# Altium project SFCMasterD.PrjPCB (part 1 of 2)
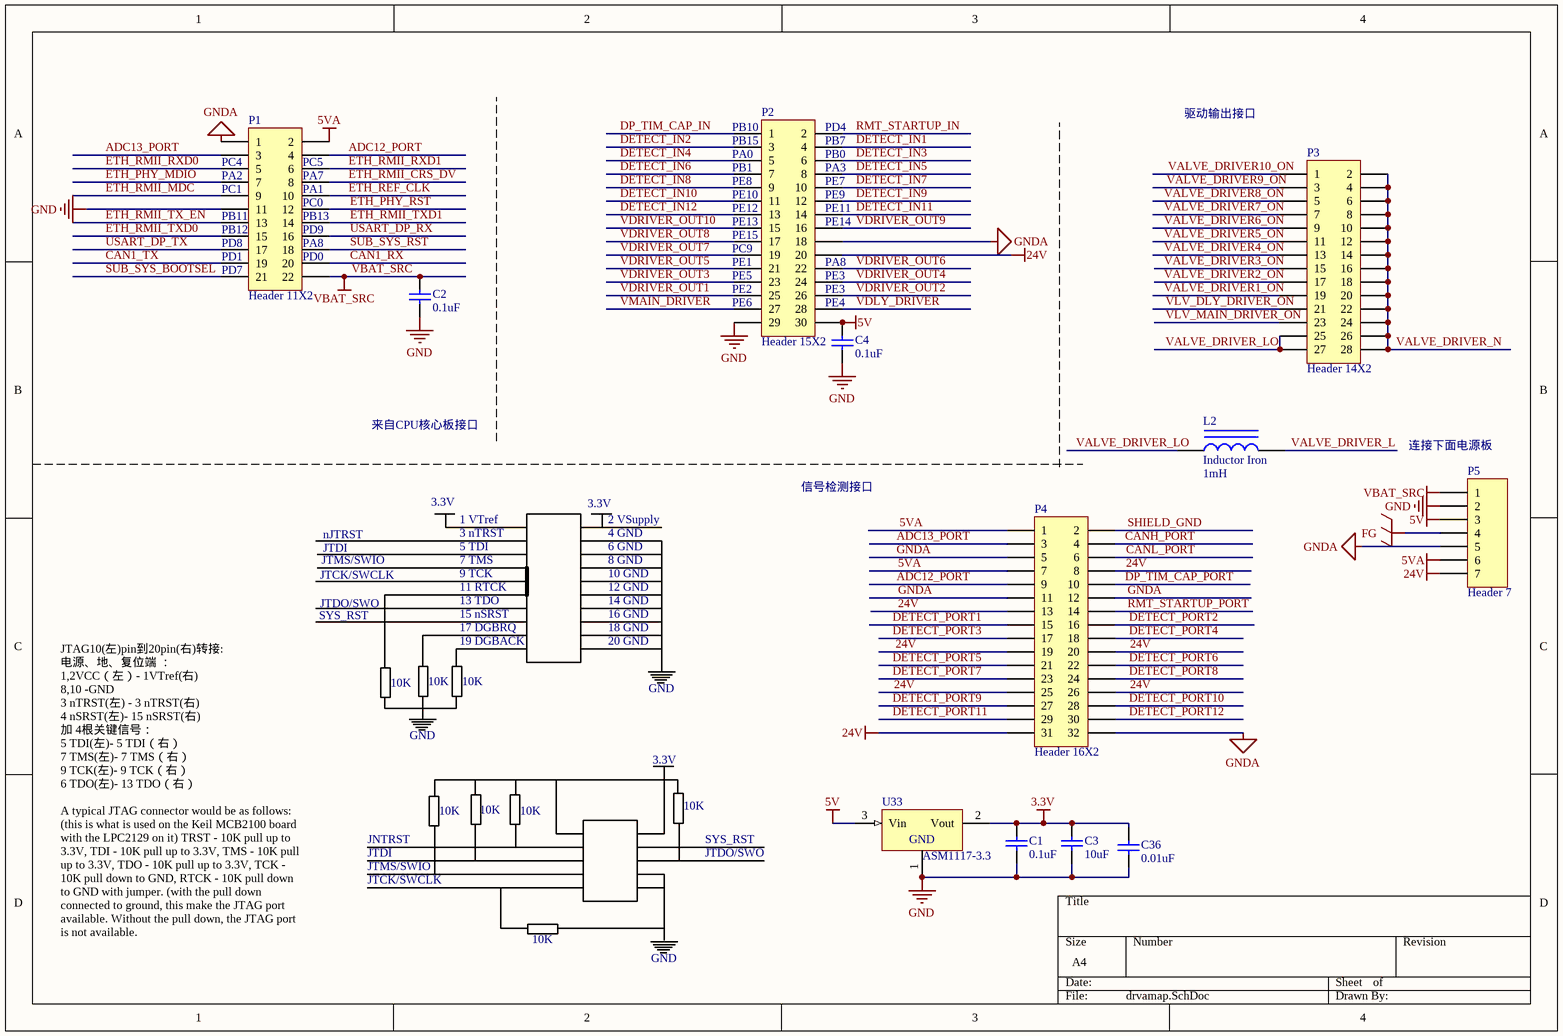
[diagram p0: drvamap.SchDoc]
17 sheets, 249 parts. Net scope: global (net labels, ports and power ports of the same name join across sheets).
Board file: SFCmasterD.PcbDoc
Sheets:
  drvamap.SchDoc
  drvcomdp.SchDoc
  drvcomm.SchDoc
  drveth.SchDoc
  drvinput0.SchDoc
  drvinput1.SchDoc
  drvinput2.SchDoc
  drvinput3.SchDoc
  drvinput4.SchDoc
  drvinput5.SchDoc
  drvinput6.SchDoc
  drvoutput0.SchDoc
  drvoutput1.SchDoc
  drvoutput2.SchDoc
  drvoutput3.SchDoc
  drvoutput4.SchDoc
  drvoutput5.SchDoc

## Sheet drvamap.SchDoc: JKA 2.0 原理图
size A4; Author: JACK; CompanyName: 北京康洁之晨水处理技术有限公司; DrawnBy: 郭相炳; Organization: 北京康洁; DocumentNumber: 6; Revision: 2.0; SheetNumber: 6; SheetTotal: 6; ImagePath: E:\JKAdoc\data\LOGO.jpg; ProjectName: JKA2.0

### Parts
C1  0.1uF  [CAPC2012M]
C2  0.1uF  [CAPC2012M]
C3  10uF  [CAPC2012M]
C4  0.1uF  [CAPC2012M]
C36  0.01uF  [CAPC2012M]
L2  Inductor Iron  value 1mH  [CAPPR5-8x8A]
P1  Header 11X2  [HDR2X11]
P2  Header 15X2  [HDR2X15]
P3  Header 14X2  [DG127A-3.81-14]
P4  Header 16X2  [DG127A-3.81-16]
P5  Header 7  [HDR1X7]
U33  ASM1117-3.3  [SOT-223]

### Nets
3.3V: C1.2 C3.2 C36.2 U33.2(Vout)
5V: C4.1 P2.30 P5.3 U33.3(Vin)
5VA: P1.2 P4.1 P4.7 P5.6
24V: P2.20 P4.8 P4.13 P4.19 P4.20 P4.25 P4.26 P4.31 P5.7
FG: P5.4
GND: C1.1 C2.2 C3.1 C4.2 C36.1 P1.11 P2.29 P5.2 U33.1(GND)
GNDA: P1.1 P2.18 P4.5 P4.11 P4.12 P4.32 P5.5
VBAT_SRC: C2.1 P1.22 P5.1
ADC12_PORT: P1.4 P4.9
ADC13_PORT: P1.3 P4.3
CAN1_RX: P1.20
CAN1_TX: P1.19
CANH_PORT: P4.4
CANL_PORT: P4.6
DETECT_IN1: P2.4
DETECT_IN2: P2.3
DETECT_IN3: P2.6
DETECT_IN4: P2.5
DETECT_IN5: P2.8
DETECT_IN6: P2.7
DETECT_IN7: P2.10
DETECT_IN8: P2.9
DETECT_IN9: P2.12
DETECT_IN10: P2.11
DETECT_IN11: P2.14
DETECT_IN12: P2.13
DETECT_PORT1: P4.15
DETECT_PORT2: P4.16
DETECT_PORT3: P4.17
DETECT_PORT4: P4.18
DETECT_PORT5: P4.21
DETECT_PORT6: P4.22
DETECT_PORT7: P4.23
DETECT_PORT8: P4.24
DETECT_PORT9: P4.27
DETECT_PORT10: P4.28
DETECT_PORT11: P4.29
DETECT_PORT12: P4.30
DP_TIM_CAP_IN: P2.1
DP_TIM_CAP_PORT: P4.10
ETH_PHY_MDIO: P1.7
ETH_PHY_RST: P1.12
ETH_REF_CLK: P1.10
ETH_RMII_CRS_DV: P1.8
ETH_RMII_MDC: P1.9
ETH_RMII_RXD0: P1.5
ETH_RMII_RXD1: P1.6
ETH_RMII_TX_EN: P1.13
ETH_RMII_TXD0: P1.15
ETH_RMII_TXD1: P1.14
RMT_STARTUP_IN: P2.2
RMT_STARTUP_PORT: P4.14
SHIELD_GND: P4.2
SUB_SYS_BOOTSEL: P1.21
SUB_SYS_RST: P1.18
USART_DP_RX: P1.16
USART_DP_TX: P1.17
VALVE_DRIVER1_ON: P3.19
VALVE_DRIVER2_ON: P3.17
VALVE_DRIVER3_ON: P3.15
VALVE_DRIVER4_ON: P3.13
VALVE_DRIVER5_ON: P3.11
VALVE_DRIVER6_ON: P3.9
VALVE_DRIVER7_ON: P3.7
VALVE_DRIVER8_ON: P3.5
VALVE_DRIVER9_ON: P3.3
VALVE_DRIVER10_ON: P3.1
VALVE_DRIVER_L: L2.2
VALVE_DRIVER_LO: L2.1 P3.25 P3.27
VALVE_DRIVER_N: P3.2 P3.4 P3.6 P3.8 P3.10 P3.12 P3.14 P3.16 P3.18 P3.20 P3.22 P3.24 P3.26 P3.28
VDLY_DRIVER: P2.28
VDRIVER_OUT1: P2.25
VDRIVER_OUT2: P2.26
VDRIVER_OUT3: P2.23
VDRIVER_OUT4: P2.24
VDRIVER_OUT5: P2.21
VDRIVER_OUT6: P2.22
VDRIVER_OUT7: P2.19
VDRIVER_OUT8: P2.17
VDRIVER_OUT9: P2.16
VDRIVER_OUT10: P2.15
VLV_DLY_DRIVER_ON: P3.21
VLV_MAIN_DRIVER_ON: P3.23
VMAIN_DRIVER: P2.27

### Notes on the sheet
- (near P1) PA2
- (near P1) PC4
- (near P1) PA7
- (near P1) PC5
- (near P2) PB10
- (near P2) PB1
- (near P2) PA0
- (near P2) PB15
- (near P2) PB7
- (near P2) PD4
- (near P2) PA3
- (near P2) PB0
- 驱动输出接口
- (near P1) PB11
- (near P1) PB12
- (near P1) PC1
- (near P1) PD8
- (near P1) PA1
- (near P1) PA8
- (near P1) PB13
- (near P1) PC0
- (near P1) PD9
- (near P2) PE15
- (near P2) PE12
- (near P2) PE13
- (near P2) PE10
- (near P2) PE8
- (near P2) PE14
- (near P2) PE11
- (near P2) PE9
- (near P2) PE7
- (near P1) PD1
- (near P1) PD7
- (near P1) PD0
- (near P2) PE6
- (near P2) PE2
- (near P2) PE5
- (near P2) PE1
- (near P2) PC9
- (near P2) PE4
- (near P2) PE3
- (near P2) PA8
- 来自CPU核心板接口
- (near P5) 连接下面电源板
- 3.3V
- 信号检测接口
- JTCK/SWCLK
- JTMS/SWIO
- nJTRST
- JTDI
- 1 VTref
- 3 nTRST
- 5 TDI
- 7 TMS
- 9 TCK
- 2 VSupply
- 4 GND
- 6 GND
- 8 GND
- 10 GND
- SYS_RST
- JTDO/SWO
- 11 RTCK
- 13 TDO
- 15 nSRST
- 17 DGBRQ
- 19 DGBACK
- 12 GND
- 14 GND
- 16 GND
- 18 GND
- 20 GND
- 10K
- GND
- JTAG10(左)pin到20pin(右)转接:
  电源、地、复位端 ：
  1,2VCC（左）- 1VTref(右)
  8,10 -GND
  3 nTRST(左) - 3 nTRST(右)
  4 nSRST(左)- 15 nSRST(右)
  加 4根关键信号：
  5 TDI(左)- 5 TDI（右）
  7 TMS(左)- 7 TMS（右）
  9 TCK(左)- 9 TCK（右）
  6 TDO(左)- 13 TDO（右）
- JNTRST
- A typical JTAG connector would be as follows: (this is what is used on the Keil MCB2100 board with the LPC2129 on it) TRST - 10K pull up to 3.3V, TDI - 10K pull up to 3.3V, TMS - 10K pull up to 3.3V, TDO - 10K pull up to 3.3V, TCK - 10K pull down to GND, RTCK - 10K pull down to GND with jumper. (with the pull down connected to ground, this make the JTAG port available. Without the pull down, the JTAG port is not available.

### Library data of the parts
C1-C4 C36 = Cap: Capacitor; Value: 1nF; Published: 8-Jun-2000; LatestRevisionDate: 17-Jul-2002; LatestRevisionNote: Re-released for DXP Platform.; PackageReference: RAD-0.3; Publisher: Altium Limited
L2 = Inductor Iron: Magnetic-Core Inductor; Published: 24-Mar-1999; LatestRevisionDate: 17-Jul-2002; LatestRevisionNote: Re-released for DXP Platform.; PackageReference: AXIAL-0.9; Publisher: Altium Limited; PackageDescription: Axial Device, Thru-Hole; 2 Leads; 0.9 in Pin Spacing
P1 = Header 11X2: Header, 11-Pin, Dual row; LatestRevisionDate: 17-Jul-2002; LatestRevisionNote: Re-released for DXP Platform.; Publisher: Altium Limited
P2 = Header 15X2: Header, 15-Pin, Dual row; LatestRevisionDate: 17-Jul-2002; LatestRevisionNote: Re-released for DXP Platform.; Publisher: Altium Limited
P3 = Header 14X2: Header, 14-Pin, Dual row; LatestRevisionDate: 17-Jul-2002; LatestRevisionNote: Re-released for DXP Platform.; Publisher: Altium Limited
P4 = Header 16X2: Header, 16-Pin, Dual row; LatestRevisionDate: 17-Jul-2002; LatestRevisionNote: Re-released for DXP Platform.; Publisher: Altium Limited
P5 = Header 7: Header, 7-Pin; LatestRevisionDate: 17-Jul-2002; LatestRevisionNote: Re-released for DXP Platform.; Publisher: Altium Limited
U33 = LM1117T-5.0: 800mA Low-Dropout Linear Regulator

## Sheet drvcomdp.SchDoc: JKA 2.0 原理图
size A4; Author: JACK; CompanyName: 北京康洁之晨水处理技术有限公司; DrawnBy: 郭相炳; Organization: 北京康洁; DocumentNumber: 6; Revision: 2.0; SheetNumber: 6; SheetTotal: 6; ImagePath: E:\JKAdoc\data\LOGO.jpg; ProjectName: JKA2.0
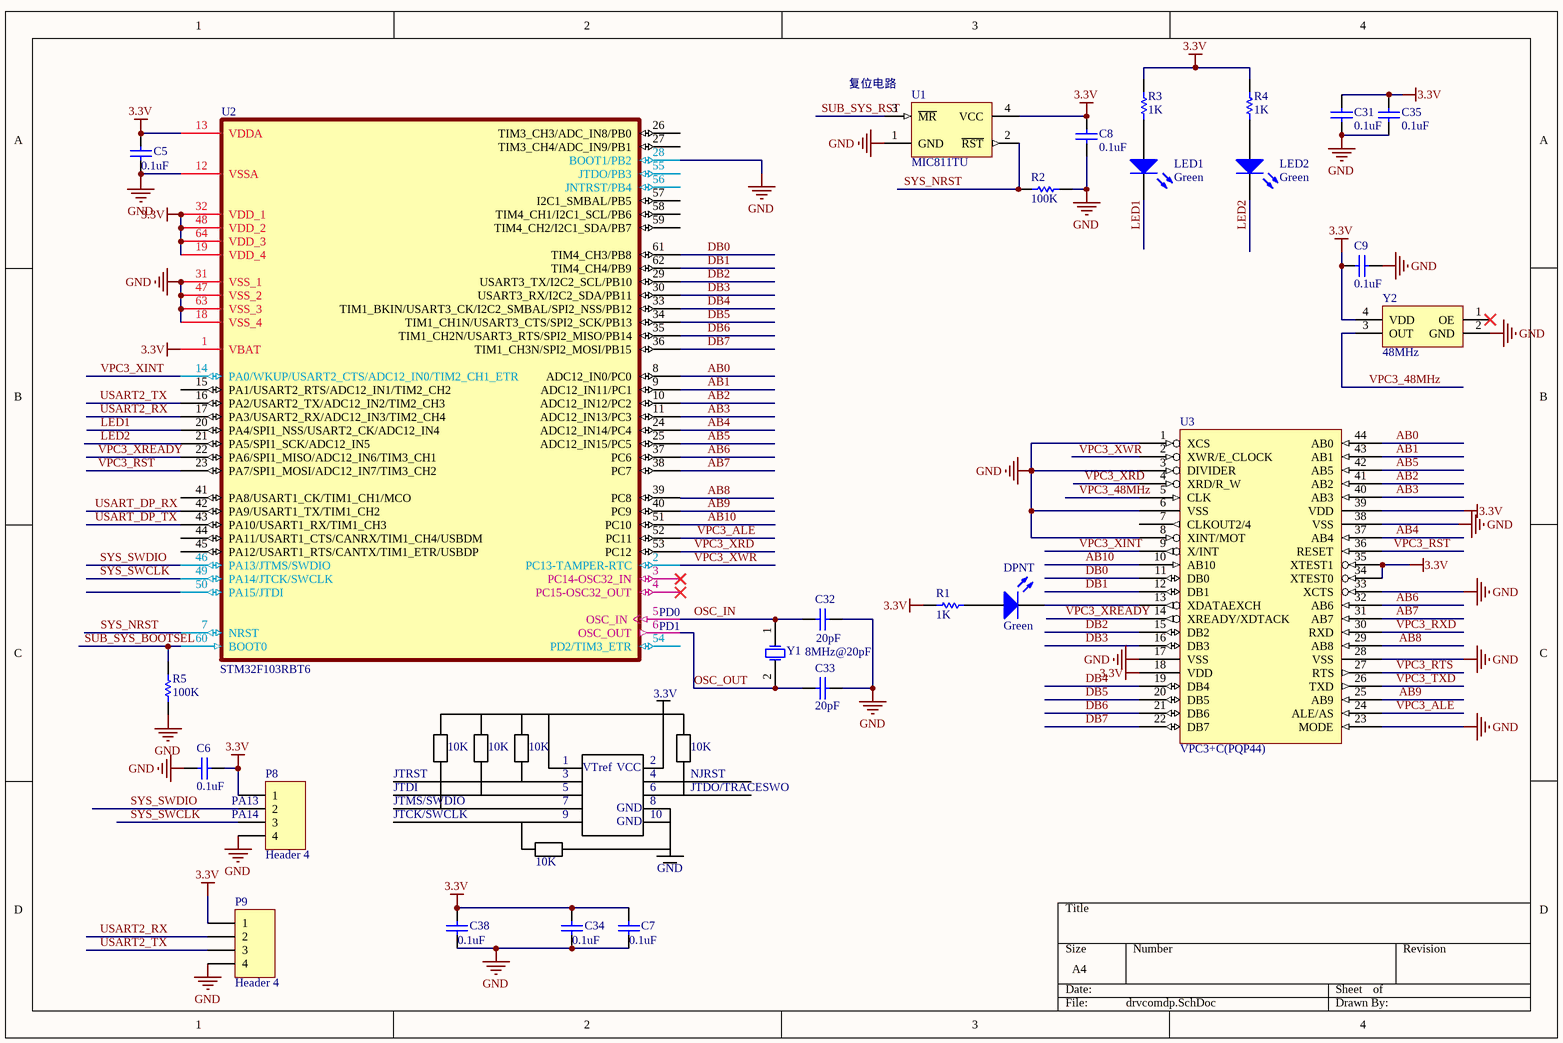
[diagram p1: drvcomdp.SchDoc]

### Parts
C5  0.1uF  [CAPC2012M]
C6  0.1uF  [CAPC2012M]
C7  0.1uF  [CAPC2012M]
C8  0.1uF  [CAPC2012M]
C9  0.1uF  [CAPC2012M]
C31  0.1uF  [CAPC2012M]
C32  20pF  [CAPC2012M]
C33  20pF  [CAPC2012M]
C34  0.1uF  [CAPC2012M]
C35  0.1uF  [CAPC2012M]
C38  0.1uF  [CAPC2012M]
DPNT  Green  [CD2012-0805]
LED1  Green  [CD2012-0805]
LED2  Green  [CD2012-0805]
P8  Header 4  [HDR1x4H-2.0]
P9  Header 4  [HDR1x4H-2.0]
R1  1K  [RESC2012M]
R2  100K  [RESC2012M]
R3  1K  [RESC2012M]
R4  1K  [RESC2012M]
R5  100K  [RESC2012M]
U1  MIC811TU  [SOT-143_N]
U2  STM32F103RBT6  [LQFP64]
U3  VPC3+C(PQP44)  [PQFP44]
Y1  8MHz@20pF  [HC-49U]
Y2  value 48MHz  [X-CP3225]  (hidden comment: XATLS)

### Nets
3.3V: C5.2 C6.2 C7.2 C8.2 C9.1 C31.1 C34.2 C35.1 C38.2 P8.1 P9.1 R1.2 R3.1 R4.1 U1.4(VCC) U2.1(VBAT) U2.13(VDDA) U2.19(VDD_4) U2.32(VDD_1) U2.48(VDD_2) U2.64(VDD_3) U3.18(VDD) U3.34(XTEST0) U3.35(XTEST1) U3.39(VDD) Y2.4(VDD)
GND: C5.1 C6.1 C7.1 C8.1 C9.2 C31.2 C32.1 C33.1 C34.1 C35.2 C38.1 P8.4 P9.4 R2.2 R5.1 U1.1(GND) U2.12(VSSA) U2.18(VSS_4) U2.28(BOOT1/PB2) U2.31(VSS_1) U2.47(VSS_2) U2.63(VSS_3) U3.1(XCS) U3.3(DIVIDER) U3.6(VSS) U3.8(XINT/MOT) U3.17(VSS) U3.23(MODE) U3.28(VSS) U3.33(XCTS) U3.38(VSS) Y2.2(GND)
AB0: U2.8(ADC12_IN0/PC0) U3.44(AB0)
AB1: U2.9(ADC12_IN11/PC1) U3.43(AB1)
AB2: U2.10(ADC12_IN12/PC2) U3.41(AB2)
AB3: U2.11(ADC12_IN13/PC3) U3.40(AB3)
AB4: U2.24(ADC12_IN14/PC4) U3.37(AB4)
AB5: U2.25(ADC12_IN15/PC5) U3.42(AB5)
AB6: U2.37(PC6) U3.32(AB6)
AB7: U2.38(PC7) U3.31(AB7)
AB8: U2.39(PC8) U3.29(AB8)
AB9: U2.40(PC9) U3.25(AB9)
AB10: U2.51(PC10) U3.10(AB10)
DB0: U2.61(TIM4_CH3/PB8) U3.11(DB0)
DB1: U2.62(TIM4_CH4/PB9) U3.12(DB1)
DB2: U2.29(USART3_TX/I2C2_SCL/PB10) U3.15(DB2)
DB3: U2.30(USART3_RX/I2C2_SDA/PB11) U3.16(DB3)
DB4: U2.33(TIM1_BKIN/USART3_CK/I2C2_SMBAL/SPI2_NSS/PB12) U3.19(DB4)
DB5: U2.34(TIM1_CH1N/USART3_CTS/SPI2_SCK/PB13) U3.20(DB5)
DB6: U2.35(TIM1_CH2N/USART3_RTS/SPI2_MISO/PB14) U3.21(DB6)
DB7: U2.36(TIM1_CH3N/SPI2_MOSI/PB15) U3.22(DB7)
LED1: LED1.2(K) U2.20(PA4/SPI1_NSS/USART2_CK/ADC12_IN4)
LED2: LED2.2(K) U2.21(PA5/SPI1_SCK/ADC12_IN5)
OSC_IN: C32.2 U2.5(OSC_IN) Y1.1(OSC1)
OSC_OUT: C33.2 U2.6(OSC_OUT) Y1.2(OSC2)
SUB_SYS_BOOTSEL: R5.2 U2.60(BOOT0)
SUB_SYS_RST: U1.3(~{MR})
SYS_NRST: R2.1 U1.2(~{RST}) U2.7(NRST)
SYS_SWCLK: P8.3 U2.49(PA14/JTCK/SWCLK)
SYS_SWDIO: P8.2 U2.46(PA13/JTMS/SWDIO)
USART2_RX: P9.2 U2.17(PA3/USART2_RX/ADC12_IN3/TIM2_CH4)
USART2_TX: P9.3 U2.16(PA2/USART2_TX/ADC12_IN2/TIM2_CH3)
USART_DP_RX: U2.42(PA9/USART1_TX/TIM1_CH2)
USART_DP_TX: U2.43(PA10/USART1_RX/TIM1_CH3)
VPC3_48MHz: U3.5(CLK) Y2.3(OUT)
VPC3_ALE: U2.52(PC11) U3.24(ALE/AS)
VPC3_RST: U2.23(PA7/SPI1_MOSI/ADC12_IN7/TIM3_CH2) U3.36(RESET)
VPC3_RTS: U3.27(RTS)
VPC3_RXD: U3.30(RXD)
VPC3_TXD: U3.26(TXD)
VPC3_XINT: U2.14(PA0/WKUP/USART2_CTS/ADC12_IN0/TIM2_CH1_ETR) U3.9(X/INT)
VPC3_XRD: U2.53(PC12) U3.4(XRD/R_W)
VPC3_XREADY: U2.22(PA6/SPI1_MISO/ADC12_IN6/TIM3_CH1) U3.14(XREADY/XDTACK)
VPC3_XWR: U2.2(PC13-TAMPER-RTC) U3.2(XWR/E_CLOCK)
NetDPNT_1: DPNT.1(A) R1.1
NetDPNT_2: DPNT.2(K) U3.13(XDATAEXCH)
NetLED1_1: LED1.1(A) R3.2
NetLED2_1: LED2.1(A) R4.2

Not connected (* = marked no-connect by the designer): U2 3(PC14-OSC32_IN)* 4(PC15-OSC32_OUT)* 15(PA1/USART2_RTS/ADC12_IN1/TIM2_CH2) 26(TIM3_CH3/ADC_IN8/PB0) 27(TIM3_CH4/ADC_IN9/PB1) 41(PA8/USART1_CK/TIM1_CH1/MCO) 44(PA11/USART1_CTS/CANRX/TIM1_CH4/USBDM) 45(PA12/USART1_RTS/CANTX/TIM1_ETR/USBDP) 50(PA15/JTDI) 54(PD2/TIM3_ETR) 55(JTDO/PB3) 56(JNTRST/PB4) 57(I2C1_SMBAL/PB5) 58(TIM4_CH1/I2C1_SCL/PB6) 59(TIM4_CH2/I2C1_SDA/PB7); U3 7(CLKOUT2/4); Y2 1(OE)*

### Notes on the sheet
- (near U1) 复位电路
- (near U2) PD1
- (near U2) PD0
- (near U2) 3.3V
- JTRST
- JTDI
- 10K
- 1
- 3
- 5
- VTref
- VCC
- 2
- 4
- 6
- NJRST
- JTDO/TRACESWO
- (near P8) PA13
- (near P8) PA14
- JTMS/SWDIO
- JTCK/SWCLK
- 7
- 9
- GND
- 8
- 10
- (near C7) GND

### Library data of the parts
C5-C9 C31 C34 C35 C38 = Cap: Capacitor; Value: 1nF; Published: 8-Jun-2000; LatestRevisionDate: 17-Jul-2002; LatestRevisionNote: Re-released for DXP Platform.; PackageReference: RAD-0.3; Publisher: Altium Limited
C32 C33 = Cap: Capacitor; Value: 100pF; Published: 8-Jun-2000; LatestRevisionDate: 17-Jul-2002; LatestRevisionNote: Re-released for DXP Platform.; PackageReference: RAD-0.3; Publisher: Altium Limited
DPNT LED1 LED2 = LED1: Green LED,Output indicate.; Published: 8-Jun-2000; LatestRevisionDate: 08-Jul-2005; LatestRevisionNote: Mech Layer 1 removed.; PackageReference: LED-1; Publisher: Altium Limited
P8 P9 = Header 4: Header, 4-Pin; LatestRevisionDate: 17-Jul-2002; LatestRevisionNote: Re-released for DXP Platform.; Publisher: Altium Limited
R1-R5 = Res1: Resistor; Value: 10K; Published: 8-Jun-2000; LatestRevisionDate: 17-Jul-2002; LatestRevisionNote: Re-released for DXP Platform.; PackageReference: AXIAL-0.3; Publisher: Altium Limited
U1 = MAX811-EUS-T: 4-Pin 礟 Voltage Monitors with Manual Reset Input; Published: 16-Jan-2001; LatestRevisionDate: 29-May-2009; LatestRevisionNote: IPC-7351 Footprint Added.; DatasheetVersion: Feb-1998; PackageVersion: Feb-1998; PackageReference: SOT143; Publisher: Altium Limited; PackageDescription: 4-Pin SOT-143 Package 1.9 mm Pitch, 2.3 mm Lead Span; ComponentLink1Description: Manufacturer Link; ComponentLink1URL: http://www.maxim-ic.com/; ComponentLink2Description: Datasheet; ComponentLink2URL: http://pdfserv.maxim-ic.com/en/ds/MAX811-MAX812.pdf
U2 = STM32F103RBT6: STM32 ARM-based 32-bit MCU with 128 Kbytes Flash, 64-pin LQFP, Industrial Temperature; Published: *; DatasheetVersion: *; PackageVersion: *; PackageReference: *; Publisher: *; PackageDescription: *; ComponentLink1Description: *; ComponentLink1URL: *; ComponentLink2Description: *; ComponentLink2URL: *
U3 = VPC3+C(PQP44): a communication chip with processor interface for  intelligent PROFIBUS DP-Slave applications
Y1 = XTAL: Crystal Oscillator; Published: 8-Jun-2000; LatestRevisionDate: 17-Jul-2002; LatestRevisionNote: Re-released for DXP Platform.; PackageReference: R38; Publisher: Altium Limited
Y2 = XATLS: 贴片有源晶振

## Sheet drvcomm.SchDoc: JKA 2.0 原理图
size A4; Author: JACK; CompanyName: 北京康洁之晨水处理技术有限公司; DrawnBy: 郭相炳; Organization: 北京康洁; DocumentNumber: 6; Revision: 2.0; SheetNumber: 6; SheetTotal: 6; ImagePath: E:\JKAdoc\data\LOGO.jpg; ProjectName: JKA2.0
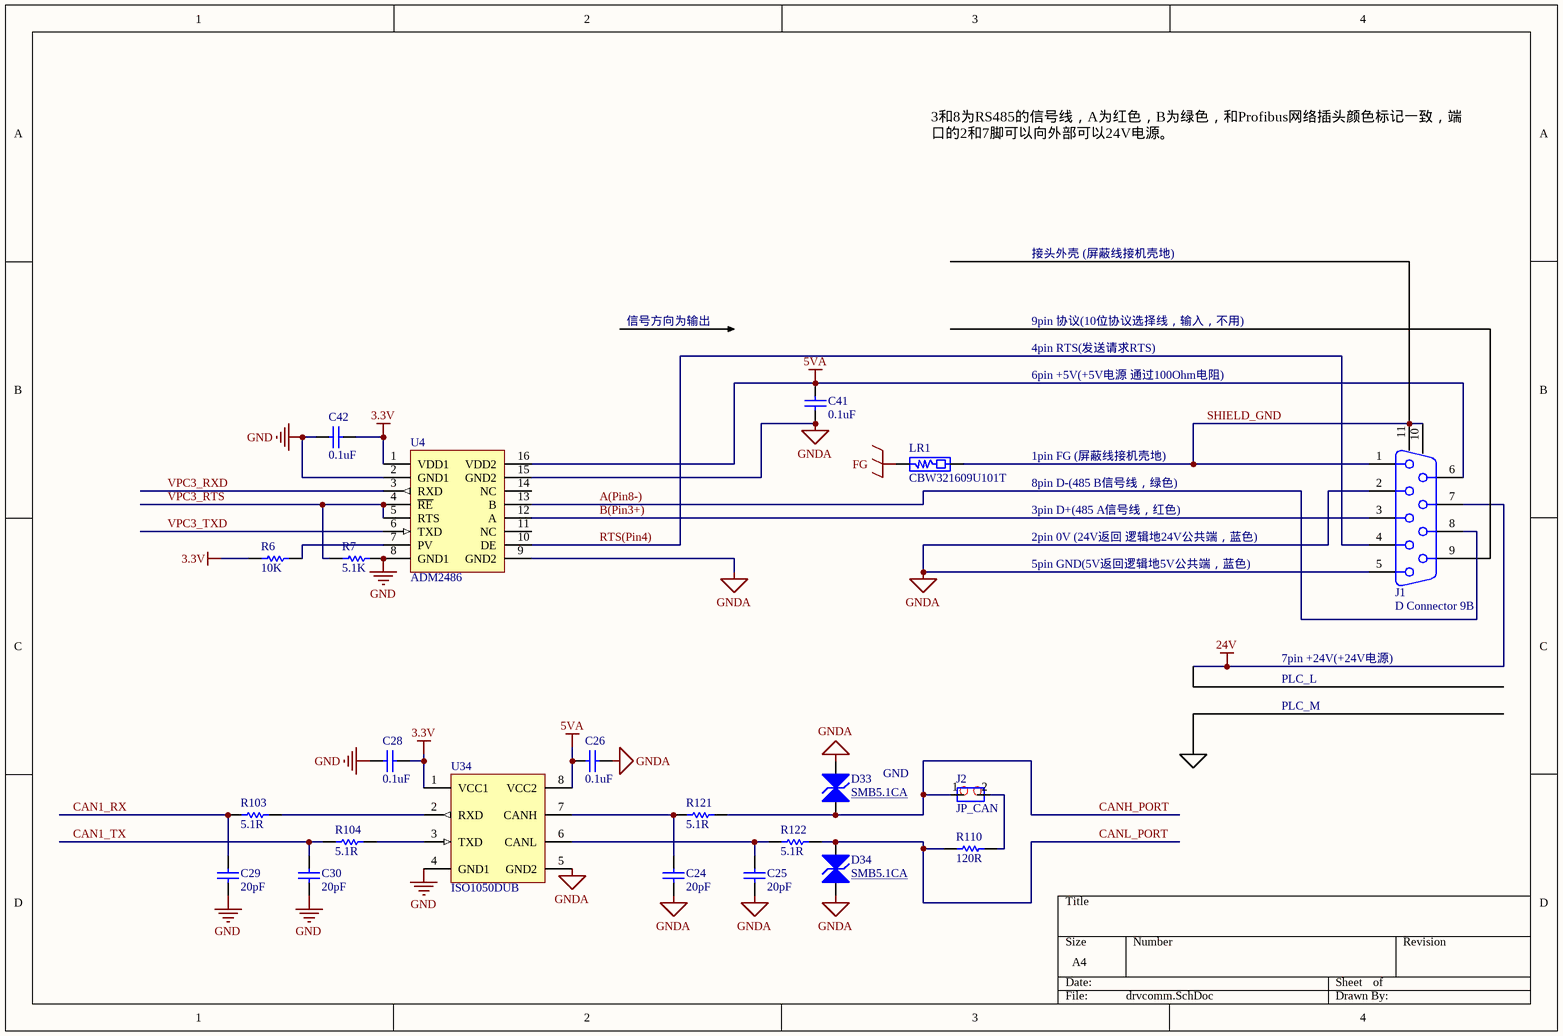
[diagram p2: drvcomm.SchDoc]

### Parts
C24  20pF  [CAPC2012M]
C25  20pF  [CAPC2012M]
C26  0.1uF  [CAPC2012M]
C28  0.1uF  [CAPC2012M]
C29  20pF  [CAPC2012M]
C30  20pF  [CAPC2012M]
C41  0.1uF  [CAPC2012M]
C42  0.1uF  [CAPC2012M]
D33  SMB5.1CA  [SMB]
D34  SMB5.1CA  [SMB]
J1  D Connector 9B  [DSUB1.385-2H9BL]
J2  JP_CAN  [DS-01]
LR1  CBW321609U101T  [INDC3216M]
R6  10K  [RESC2012M]
R7  5.1K  [RESC2012M]
R103  5.1R  [RESC2012M]
R104  5.1R  [RESC2012M]
R110  120R  [RESC2012M]
R121  5.1R  [RESC2012M]
R122  5.1R  [RESC2012M]
U4  ADM2486  [RW-16_N]
U34  ISO1050DUB  [SO-8LA]

### Nets
3.3V: C28.1 C42.1 R6.1 U4.1(VDD1) U34.1(VCC1)
5VA: C26.1 C41.1 J1.6 U4.16(VDD2) U34.8(VCC2)
24V: J1.7
FG: LR1.1
GND: C28.2 C29.1 C30.1 C42.2 R7.1 U4.2(GND1) U4.8(GND1) U34.4(GND1)
GNDA: C24.1 C25.1 C26.2 C41.2 D33.1(A) D34.1(A) J1.2 J1.5 U4.9(GND2) U4.15(GND2) U34.5(GND2)
A(Pin8-): J1.8 U4.13(B)
B(Pin3+): J1.3 U4.12(A)
CAN1_RX: C29.2 R103.2
CAN1_TX: C30.2 R104.2
CANH_PORT: D33.2(K) J2.1 R121.1
CANL_PORT: D34.2(K) R110.2 R122.1
RTS(Pin4): J1.4 U4.10(DE)
SHIELD_GND: J1.1 J1.10(MH1) J1.11(MH2) LR1.2
VPC3_RTS: R7.2 U4.4(~{RE}) U4.5(RTS)
VPC3_RXD: U4.3(RXD)
VPC3_TXD: U4.6(TXD)
NetC24_2: C24.2 R121.2 U34.7(CANH)
NetC25_2: C25.2 R122.2 U34.6(CANL)
NetJ2_2: J2.2 R110.1
NetR6_2: R6.2 U4.7(PV)
NetR103_1: R103.1 U34.2(RXD)
NetR104_1: R104.1 U34.3(TXD)

Not connected (* = marked no-connect by the designer): J1 9; U4 11(NC) 14(NC)

### Notes on the sheet
- 3和8为RS485的信号线，A为红色，B为绿色，和Profibus网络插头颜色标记一致，端口的2和7脚可以向外部可以24V电源。
- 接头外壳 (屏蔽线接机壳地)
- 信号方向为输出
- 9pin 协议(10位协议选择线，输入，不用)
- 4pin RTS(发送请求RTS)
- 6pin +5V(+5V电源 通过100Ohm电阻)
- 3pin D+(485 A信号线，红色)
- 8pin D-(485 B信号线，绿色)
- 1pin FG (屏蔽线接机壳地)
- 2pin 0V (24V返回 逻辑地24V公共端，蓝色)
- 5pin GND(5V返回逻辑地5V公共端，蓝色)
- 7pin +24V(+24V电源)
- PLC_L
- PLC_M
- GND

### Library data of the parts
C24-C26 C28-C30 C41 C42 = Cap: Capacitor; Value: 1nF; Published: 8-Jun-2000; LatestRevisionDate: 17-Jul-2002; LatestRevisionNote: Re-released for DXP Platform.; PackageReference: RAD-0.3; Publisher: Altium Limited
D33 D34 = Bi-dir TVS Diode: Published: 8-Jun-2000; LatestRevisionDate: 17-Jul-2002; LatestRevisionNote: Re-released for DXP Platform.; PackageReference: DIODE-0.7; Publisher: Altium Limited
J1 = D Connector 9B: Receptacle Assembly, 9 Position, Upright; PackageDocument: B; Positions: 15; Gender: Receptacle Header; Published: 15-Jun-2001; LatestRevisionDate: 17-Jul-2002; LatestRevisionNote: Re-released for DXP Platform.; DatasheetDocument: 24-Nov-1999; PackageReference: 788574; Publisher: Altium Limited; Orientation: Right Angle
J2 = JK2H: 'Dial Switch pitch 7.62mm
LR1 = BLM10/11/21/31/41: EMI FILTERS,DC Resistance max.0.05~1.5 ohms,10 ~ 1000 ohms at 100MHz  Frequency
R6 = Res1: Resistor; Published: 8-Jun-2000; LatestRevisionDate: 17-Jul-2002; LatestRevisionNote: Re-released for DXP Platform.; PackageReference: AXIAL-0.3; Publisher: Altium Limited; Value: 10K
R7 R103 R104 R110 R121 R122 = Res1: Resistor; Value: 10K; Published: 8-Jun-2000; LatestRevisionDate: 17-Jul-2002; LatestRevisionNote: Re-released for DXP Platform.; PackageReference: AXIAL-0.3; Publisher: Altium Limited
U4 = ADM2486: Isolated RS-485 Transceiver
U34 = ISO1050DUB: 隔离型CAN接口芯片

## Sheet drveth.SchDoc: JKA 2.0 原理图
size A4; Author: JACK; CompanyName: 北京康洁之晨水处理技术有限公司; DrawnBy: 郭相炳; Organization: 北京康洁; DocumentNumber: 6; Revision: 2.0; SheetNumber: 6; SheetTotal: 6; ImagePath: E:\JKAdoc\data\LOGO.jpg; ProjectName: JKA2.0
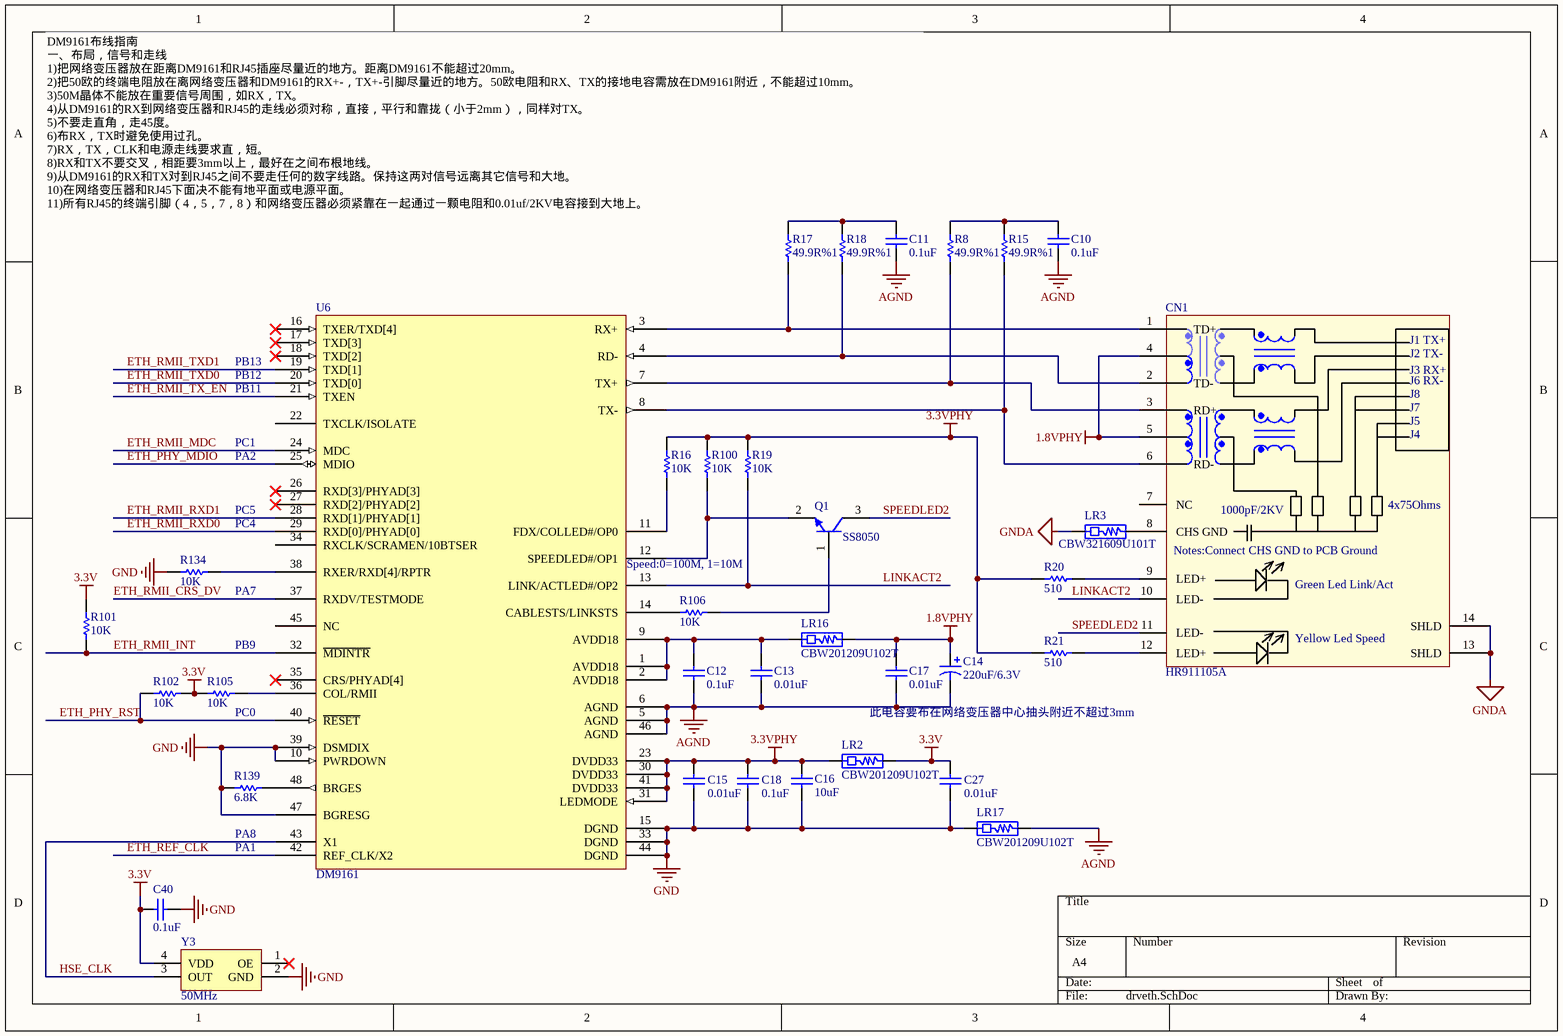
[diagram p3: drveth.SchDoc]

### Parts
C10  0.1uF  [CAPC2012M]
C11  0.1uF  [CAPC2012M]
C12  0.1uF  [CAPC2012M]
C13  0.01uF  [CAPC2012M]
C14  220uF/6.3V  [CAPC3528MS]
C15  0.01uF  [CAPC2012M]
C16  10uF  [CAPC2012M]
C17  0.01uF  [CAPC2012M]
C18  0.1uF  [CAPC2012M]
C27  0.01uF  [CAPC2012M]
C40  0.1uF  [CAPC2012M]
CN1  HR911105A  [HR911105A(RJ-45)]
LR2  CBW201209U102T  [INDC2012M]
LR3  CBW321609U101T  [INDC3216M]
LR16  CBW201209U102T  [INDC2012M]
LR17  CBW201209U102T  [INDC2012M]
Q1  SS8050  [SOT-23_N]
R8  49.9R%1  [RESC2012M]
R15  49.9R%1  [RESC2012M]
R16  10K  [RESC2012M]
R17  49.9R%1  [RESC2012M]
R18  49.9R%1  [RESC2012M]
R19  10K  [RESC2012M]
R20  510  [RESC2012M]
R21  510  [RESC2012M]
R100  10K  [RESC2012M]
R101  10K  [RESC2012M]
R102  10K  [RESC2012M]
R105  10K  [RESC2012M]
R106  10K  [RESC2012M]
R134  10K  [RESC2012M]
R139  6.8K  [RESC2012M]
U6  DM9161  [LQFP48_L]
Y3  value 50MHz  [X-CP3225]  (hidden comment: XATLS)

### Nets
1.8VPHY: C14.1 C17.1 CN1.4 CN1.5 LR16.1
3.3V: C27.1 C40.1 LR2.1 R101.1 R102.2 R105.1 Y3.4(VDD)
3.3VPHY: C15.1 C16.1 C18.1 LR2.2 R16.1 R19.1 R20.1 R21.1 R100.1 U6.23(DVDD33) U6.30(DVDD33) U6.31(LEDMODE) U6.41(DVDD33)
AGND: C10.2 C11.2 C12.2 C13.2 C14.2 C17.2 LR17.1 U6.5(AGND) U6.6(AGND) U6.46(AGND)
GND: C15.2 C16.2 C18.2 C27.2 C40.2 LR17.2 R134.1 R139.1 U6.10(PWRDOWN) U6.15(DGND) U6.33(DGND) U6.39(DSMDIX) U6.44(DGND) U6.47(BGRESG) Y3.2(GND)
GNDA: CN1.13(SHLD) CN1.14(SHLD) LR3.2
ETH_PHY_MDIO: U6.25(MDIO)
ETH_PHY_RST: R102.1 U6.40(~{RESET})
ETH_REF_CLK: U6.42(REF_CLK/X2)
ETH_RMII_CRS_DV: U6.37(RXDV/TESTMODE)
ETH_RMII_INT: R101.2 U6.32(~{MDINTR})
ETH_RMII_MDC: U6.24(MDC)
ETH_RMII_RXD0: U6.29(RXD[0]/PHYAD[0])
ETH_RMII_RXD1: U6.28(RXD[1]/PHYAD[1])
ETH_RMII_TX_EN: U6.21(TXEN)
ETH_RMII_TXD0: U6.20(TXD[0])
ETH_RMII_TXD1: U6.19(TXD[1])
HSE_CLK: U6.43(X1) Y3.3(OUT)
LINKACT2: CN1.10(LED-) R19.2 U6.13(LINK/ACTLED#/OP2)
SPEEDLED2: CN1.11(LED-) Q1.3(C)
NetC10_1: C10.1 R8.1 R15.1
NetC11_1: C11.1 R17.1 R18.1
NetC12_1: C12.1 C13.1 LR16.2 U6.1(AVDD18) U6.2(AVDD18) U6.9(AVDD18)
NetCN1_1: CN1.1(TD+) R17.2 U6.3(RX+)
NetCN1_2: CN1.2(TD-) R18.2 U6.4(RD-)
NetCN1_3: CN1.3(RD+) R8.2 U6.7(TX+)
NetCN1_6: CN1.6(RD-) R15.2 U6.8(TX-)
NetCN1_8: CN1.8(CHS_GND) LR3.1
NetCN1_9: CN1.9(LED+) R20.2
NetCN1_12: CN1.12(LED+) R21.2
NetQ1_1: Q1.1(B) R106.2
NetQ1_2: Q1.2(E) R100.2 U6.12(SPEEDLED#/OP1)
NetR16_2: R16.2 U6.11(FDX/COLLED#/OP0)
NetR105_2: R105.2 U6.36(COL/RMII)
NetR106_1: R106.1 U6.14(CABLESTS/LINKSTS)
NetR134_2: R134.2 U6.38(RXER/RXD[4]/RPTR)
NetR139_2: R139.2 U6.48(BRGES)

Not connected (* = marked no-connect by the designer): CN1 7(NC); U6 16(TXER/TXD[4])* 17(TXD[3])* 18(TXD[2])* 22(TXCLK/ISOLATE) 26(RXD[3]/PHYAD[3])* 27(RXD[2]/PHYAD[2])* 34(RXCLK/SCRAMEN/10BTSER) 35(CRS/PHYAD[4])* 45(NC); Y3 1(OE)*

### Notes on the sheet
- DM9161布线指南
  一、布局，信号和走线
  1)把网络变压器放在距离DM9161和RJ45插座尽量近的地方。距离DM9161不能超过20mm。
  2)把50欧的终端电阻放在离网络变压器和DM9161的RX+-，TX+-引脚尽量近的地方。50欧电阻和RX、TX的接地电容需放在DM9161附近，不能超过10mm。
  3)50M晶体不能放在重要信号周围，如RX，TX。
  4)从DM9161的RX到网络变压器和RJ45的走线必须对称，直接，平行和靠拢（小于2mm），同样对TX。
  5)不要走直角，走45度。
  6)布RX，TX时避免使用过孔。
  7)RX，TX，CLK和电源走线要求直，短。
  8)RX和TX不要交叉，相距要3mm以上，最好在之间布根地线。
  9)从DM9161的RX和TX对到RJ45之间不要走任何的数字线路。保持这两对信号远离其它信号和大地。
  10)在网络变压器和RJ45下面决不能有地平面或电源平面。
  11)所有RJ45的终端引脚（4，5，7，8）和网络变压器必须紧靠在一起通过一颗电阻和0.01uf/2KV电容接到大地上。
  12)   BANDGAP电阻必须布在尽量靠近47和48脚旁边（不超过3mm）。避免走任何高速信号在这个电阻附近（到晶振必须大于3mm）。
  二、供电，退耦电容
  1）退耦电容必须布在尽量靠近电源焊盘附近（不超过2.5mm），推荐容量为0.1或者0。01uf。
  2） 退藕电容必须足够，已保证以下效果：
  （1）所有的模拟VDD和数字VDD  的纹波小于50mVpp
  （2）所有的模拟地和数字地的纹波小于50mVpp
  （3）所有通过模拟数字的AC噪音要小于100mVpp
  3）保守的做法是每个引脚接两个退耦电容。0.1uf和0.01uf个一个。
  4） 这就是说在中心抽头AVDD和AGND之间必须布一个0.01uf的退耦电容。这个退耦电容必须布在网络变压器中心抽头附近，越近越好。
  三、地平面布线
  1）地平面分隔会增加EMI的排放量。
  2） 地平面需要分成模拟地和数字地，其之间连接的线必须远离DM9161的AGND脚。
  3） 所有的模拟地引脚不能直接（5，6，46）短接，必须直接连到模拟地平面上。
  4） 模拟地平面尽可能的大。
  四、电源层分隔
  1）使用的铁氧体磁珠，在100MHZ和200mA电流情况下，阻值大于100欧。铁氧体磁珠两边必须各放一个10uf，0.1uf和0.01uf的电容。
  2） 必须把模拟电源层和数字电源层隔离开。
  五、和Mac连接
  和mac连接的线必须短而直。
  TXD[0-3]何TXCLK的长度差异不能超过2cm
  RXD[0-3]何RXCLK的长度差异不能超过2cm
- PB12
- PB13
- PB11
- PC1
- PA2
- PC5
- PC4
- (near U6) Speed:0=100M, 1=10M
- (near R134) PA7
- PB9
- (near R105) PC0
- 此电容要布在网络变压器中心抽头附近不超过3mm
- PA1
- PA8
- (in symbol HR911105A) J1 TX+; J2 TX-; J3 RX+; J6 RX-; J8; J7; J5; J4; 4x75Ohms; 1000pF/2KV; Notes:Connect CHS GND to PCB Ground; Green Led Link/Act; Yellow Led Speed

### Library data of the parts
C10-C13 C15-C18 C27 C40 = Cap: Capacitor; Value: 1nF; Published: 8-Jun-2000; LatestRevisionDate: 17-Jul-2002; LatestRevisionNote: Re-released for DXP Platform.; PackageReference: RAD-0.3; Publisher: Altium Limited
C14 = Cap Pol1: Polarized Capacitor (Radial); Value: 100pF; Published: 8-Jun-2000; LatestRevisionDate: 17-Jul-2002; LatestRevisionNote: Re-released for DXP Platform.; PackageReference: RB7.6-15; Publisher: Altium Limited
LR2 LR3 LR16 LR17 = BLM10/11/21/31/41: as LR1 on sheet drvcomm
Q1 = PMMT491A: NPN BISS Transistor; Published: 17-Sep-2003; LatestRevisionDate: 12-Dec-2006; LatestRevisionNote: IPC-7351 Footprint Added.; DatasheetVersion: 11-Jun-2001; PackageVersion: May-1999; PackageReference: SOT23; Publisher: Altium Limited; PackageDescription: 3-Pin SOT-23 Package 0.95 mm Pitch, 2.3 mm Lead Span; ComponentLink1Description: Manufacturer Link; ComponentLink1URL: http://www.semiconductors.philips.com/; ComponentLink2Description: Datasheet; ComponentLink2URL: http://www.semiconductors.philips.com/acrobat/datasheets/PMMT491A_5.pdf
R8 R15 R17 R18 R20 R21 R139 = Res1: Resistor; Value: 10K; Published: 8-Jun-2000; LatestRevisionDate: 17-Jul-2002; LatestRevisionNote: Re-released for DXP Platform.; PackageReference: AXIAL-0.3; Publisher: Altium Limited
R16 R19 R100-R102 R105 R106 R134 = Res1: Resistor; Published: 8-Jun-2000; LatestRevisionDate: 17-Jul-2002; LatestRevisionNote: Re-released for DXP Platform.; PackageReference: AXIAL-0.3; Publisher: Altium Limited; Value: 10K
U6 = DM9161: 网络芯片
Y3 = XATLS: 贴片有源晶振

## Sheet drvinput0.SchDoc
size A4
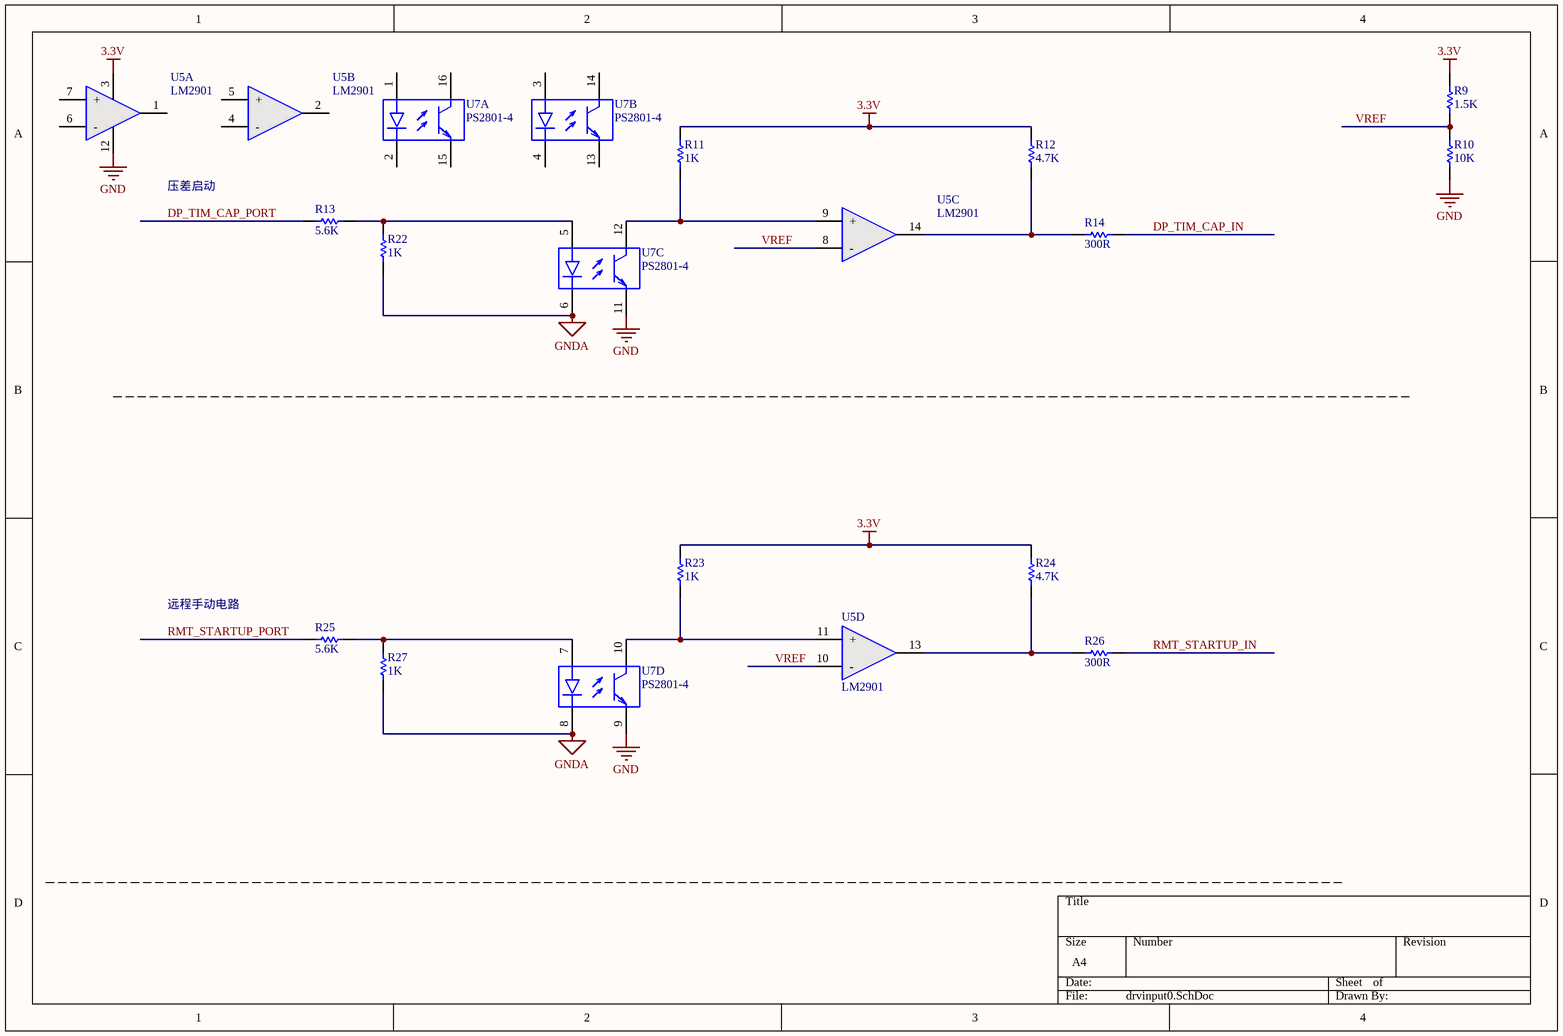
[diagram p4: drvinput0.SchDoc]

### Parts
R9  1.5K  [RESC2012M]
R10  10K  [RESC2012M]
R11  1K  [RESC2012M]
R12  4.7K  [RESC2012M]
R13  5.6K  [RESC2012M]
R14  300R  [RESC2012M]
R22  1K  [RESC2012M]
R23  1K  [RESC2012M]
R24  4.7K  [RESC2012M]
R25  5.6K  [RESC2012M]
R26  300R  [RESC2012M]
R27  1K  [RESC2012M]
U5  LM2901  [SOIC-14AM]  (parts A,B,C,D of 4)
U7  PS2801-4  [SOIC16_N]  (parts A,B,C,D of 4)

### Nets
3.3V: R9.1 R11.1 R12.2 R23.1 R24.2 U5.3(V+)
GND: R10.2 U5.12(V-) U7.9(E) U7.11(E)
GNDA: R22.1 R27.1 U7.6(-) U7.8(-)
DP_TIM_CAP_IN: R14.1
DP_TIM_CAP_PORT: R13.2
RMT_STARTUP_IN: R26.2
RMT_STARTUP_PORT: R25.2
VREF: R9.2 R10.1 U5.8(-) U5.10(-)
NetR11_2: R11.2 U5.9(+) U7.12(C)
NetR12_1: R12.1 R14.2 U5.14(OUT)
NetR13_1: R13.1 R22.2 U7.5(+)
NetR23_2: R23.2 U5.11(+) U7.10(C)
NetR24_1: R24.1 R26.1 U5.13(OUT)
NetR25_1: R25.1 R27.2 U7.7(+)

Not connected (* = marked no-connect by the designer): U5 1(OUT) 2(OUT) 4(-) 5(+) 6(-) 7(+); U7 1(+) 2(-) 3(+) 4(-) 13(E) 14(C) 15(E) 16(C)

### Notes on the sheet
- 压差启动
- 远程手动电路

### Library data of the parts
R9 R11-R14 R22-R25 R27 = Res1: Resistor; Value: 10K; Published: 8-Jun-2000; LatestRevisionDate: 17-Jul-2002; LatestRevisionNote: Re-released for DXP Platform.; PackageReference: AXIAL-0.3; Publisher: Altium Limited
R10 = Res1: Resistor; Published: 8-Jun-2000; LatestRevisionDate: 17-Jul-2002; LatestRevisionNote: Re-released for DXP Platform.; PackageReference: AXIAL-0.3; Publisher: Altium Limited; Value: 10K
R26 = Res1: Resistor; Value: 470; Published: 8-Jun-2000; LatestRevisionDate: 17-Jul-2002; LatestRevisionNote: Re-released for DXP Platform.; PackageReference: AXIAL-0.3; Publisher: Altium Limited
U5 = LM2901: 4通道差分比较器芯片
U7 = PS2801-4: The PS2801-1 and PS2801-4 are optically coupled isolators containing a GaAs light emitting diode and an NPN  silicon phototransistor in a plastic SOP for high density applications.; Published: 28-Feb-2003; LatestRevisionDate: 13-Apr-2006; LatestRevisionNote: IPC-7351 Footprint Added.; DatasheetVersion: Jan-2002, Rev. 7; PackageVersion: rev7, Jan-2002; PackageReference: 751-07; Publisher: Altium Limited; PackageDescription: 8-Pin Plastic Small Outline Integrated Circuit 1.27 mm Pitch; Code_JEDEC: MS-012-AA; Code_IPC: SOIC127P600-8; ComponentLink1Description: Manufacturer Link; ComponentLink1URL: http://www.onsemi.com/; ComponentLink2Description: Datasheet; ComponentLink2URL: http://www.onsemi.com/pub/Collateral/LM358-D.PDF

## Sheet drvinput1.SchDoc
size A4
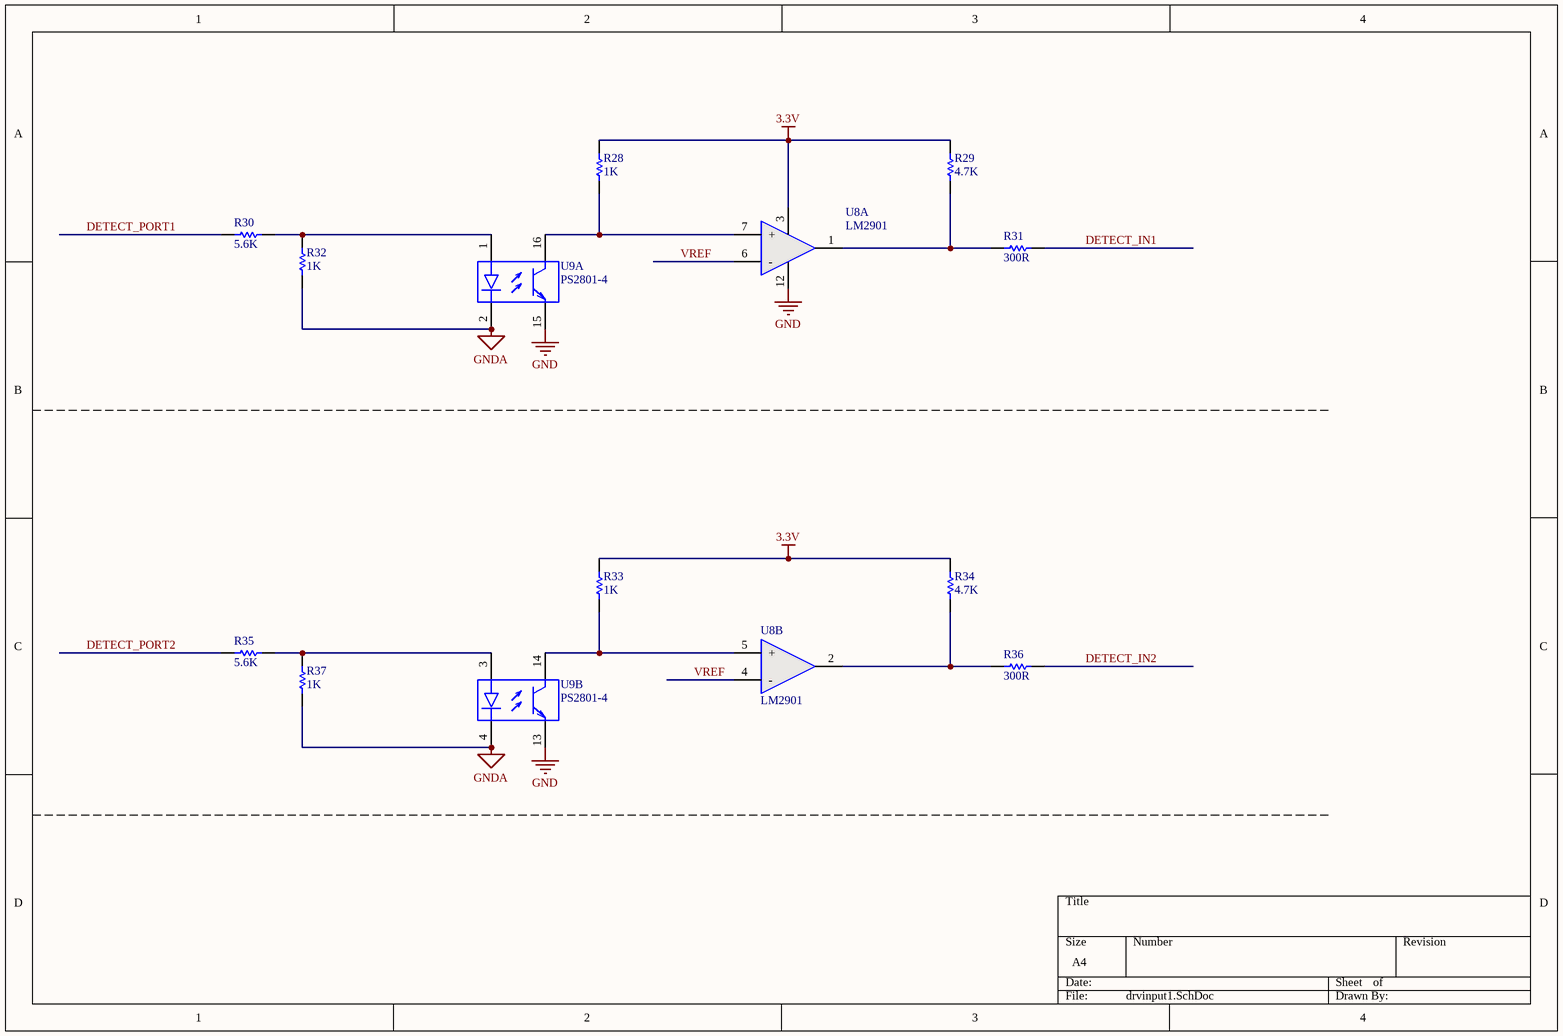
[diagram p5: drvinput1.SchDoc]

### Parts
R28  1K  [RESC2012M]
R29  4.7K  [RESC2012M]
R30  5.6K  [RESC2012M]
R31  300R  [RESC2012M]
R32  1K  [RESC2012M]
R33  1K  [RESC2012M]
R34  4.7K  [RESC2012M]
R35  5.6K  [RESC2012M]
R36  300R  [RESC2012M]
R37  1K  [RESC2012M]
U8  LM2901  [SOIC-14AM]  (parts A,B of 4)
U9  PS2801-4  [SOIC16_N]  (parts A,B of 4)

### Nets
3.3V: R28.1 R29.2 R33.1 R34.2 U8.3(V+)
GND: U8.12(V-) U9.13(E) U9.15(E)
GNDA: R32.1 R37.1 U9.2(-) U9.4(-)
DETECT_IN1: R31.1
DETECT_IN2: R36.2
DETECT_PORT1: R30.2
DETECT_PORT2: R35.2
VREF: U8.4(-) U8.6(-)
NetR28_2: R28.2 U8.7(+) U9.16(C)
NetR29_1: R29.1 R31.2 U8.1(OUT)
NetR30_1: R30.1 R32.2 U9.1(+)
NetR33_2: R33.2 U8.5(+) U9.14(C)
NetR34_1: R34.1 R36.1 U8.2(OUT)
NetR35_1: R35.1 R37.2 U9.3(+)

### Library data of the parts
R28-R35 R37 = Res1: Resistor; Value: 10K; Published: 8-Jun-2000; LatestRevisionDate: 17-Jul-2002; LatestRevisionNote: Re-released for DXP Platform.; PackageReference: AXIAL-0.3; Publisher: Altium Limited
R36 = Res1: Resistor; Value: 470; Published: 8-Jun-2000; LatestRevisionDate: 17-Jul-2002; LatestRevisionNote: Re-released for DXP Platform.; PackageReference: AXIAL-0.3; Publisher: Altium Limited
U8 = LM2901: 4通道差分比较器芯片
U9 = PS2801-4: as U7 on sheet drvinput0; Published: 28-Feb-2003; LatestRevisionDate: 13-Apr-2006; LatestRevisionNote: IPC-7351 Footprint Added.; DatasheetVersion: Jan-2002, Rev. 7; PackageVersion: rev7, Jan-2002; PackageReference: 751-07; Publisher: Altium Limited; PackageDescription: 8-Pin Plastic Small Outline Integrated Circuit 1.27 mm Pitch; Code_JEDEC: MS-012-AA; Code_IPC: SOIC127P600-8; ComponentLink1Description: Manufacturer Link; ComponentLink1URL: http://www.onsemi.com/; ComponentLink2Description: Datasheet; ComponentLink2URL: http://www.onsemi.com/pub/Collateral/LM358-D.PDF

## Sheet drvinput2.SchDoc
size A4
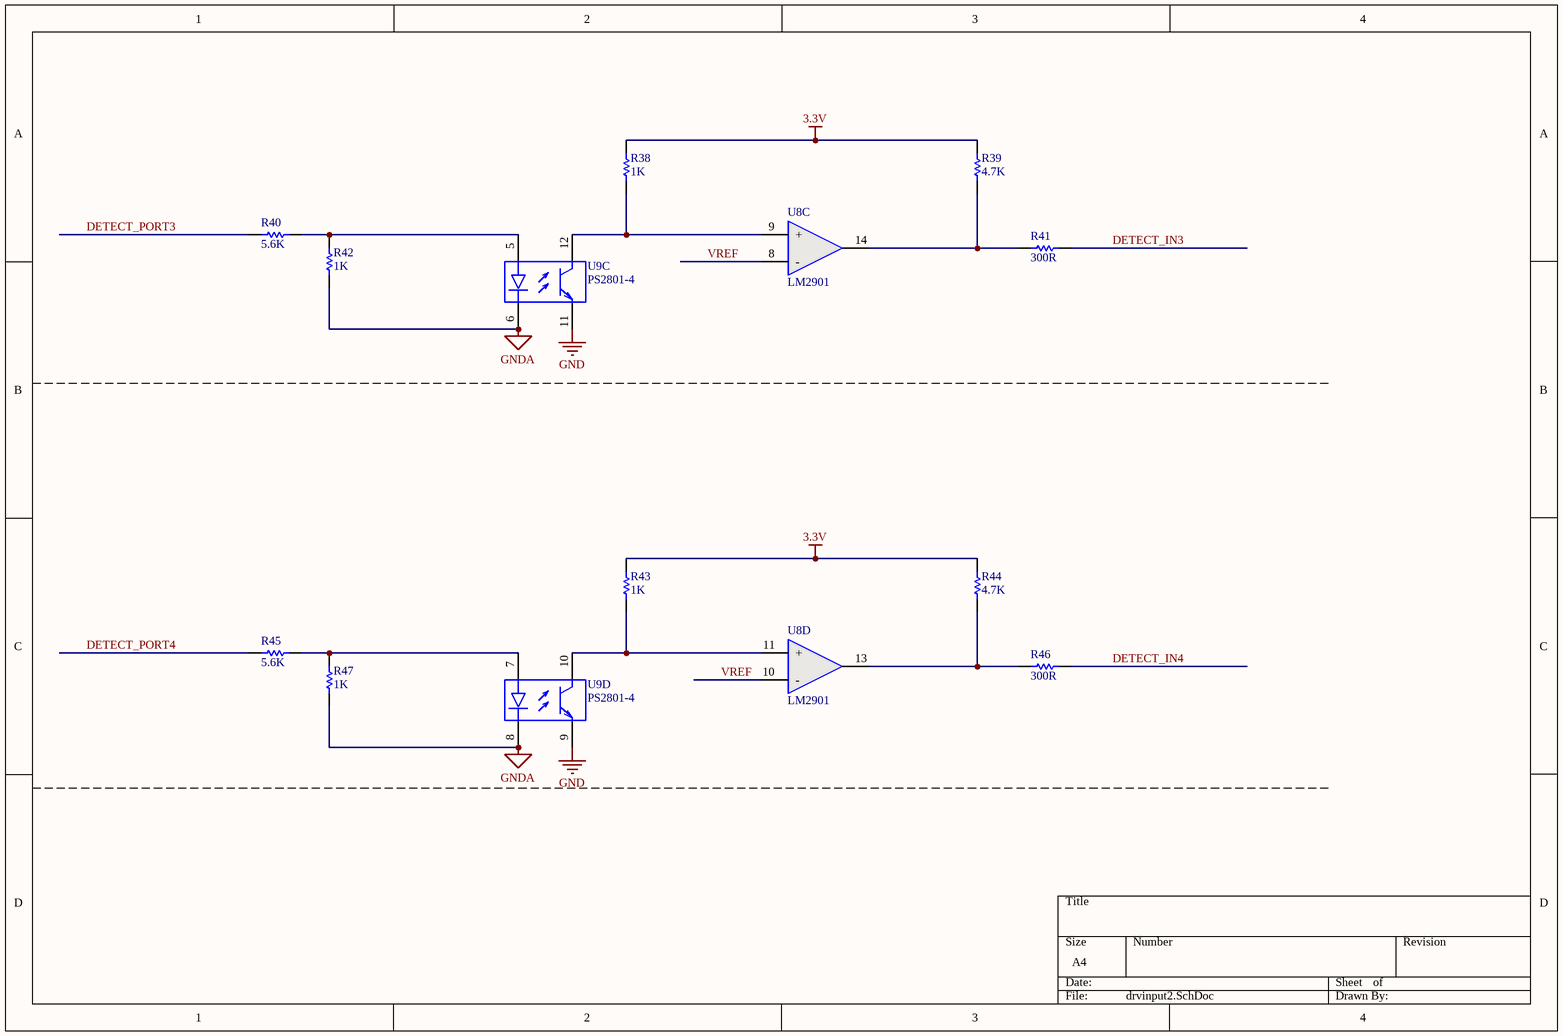
[diagram p6: drvinput2.SchDoc]

### Parts
R38  1K  [RESC2012M]
R39  4.7K  [RESC2012M]
R40  5.6K  [RESC2012M]
R41  300R  [RESC2012M]
R42  1K  [RESC2012M]
R43  1K  [RESC2012M]
R44  4.7K  [RESC2012M]
R45  5.6K  [RESC2012M]
R46  300R  [RESC2012M]
R47  1K  [RESC2012M]
U8  LM2901  [SOIC-14AM]  (parts C,D of 4)
U9  PS2801-4  [SOIC16_N]  (parts C,D of 4)

### Nets
3.3V: R38.1 R39.2 R43.1 R44.2
GND: U9.9(E) U9.11(E)
GNDA: R42.1 R47.1 U9.6(-) U9.8(-)
DETECT_IN3: R41.1
DETECT_IN4: R46.2
DETECT_PORT3: R40.2
DETECT_PORT4: R45.2
VREF: U8.8(-) U8.10(-)
NetR38_2: R38.2 U8.9(+) U9.12(C)
NetR39_1: R39.1 R41.2 U8.14(OUT)
NetR40_1: R40.1 R42.2 U9.5(+)
NetR43_2: R43.2 U8.11(+) U9.10(C)
NetR44_1: R44.1 R46.1 U8.13(OUT)
NetR45_1: R45.1 R47.2 U9.7(+)

### Library data of the parts
R38-R45 R47 = Res1: Resistor; Value: 10K; Published: 8-Jun-2000; LatestRevisionDate: 17-Jul-2002; LatestRevisionNote: Re-released for DXP Platform.; PackageReference: AXIAL-0.3; Publisher: Altium Limited
R46 = Res1: Resistor; Value: 470; Published: 8-Jun-2000; LatestRevisionDate: 17-Jul-2002; LatestRevisionNote: Re-released for DXP Platform.; PackageReference: AXIAL-0.3; Publisher: Altium Limited
U8 = LM2901: 4通道差分比较器芯片
U9 = PS2801-4: as U7 on sheet drvinput0; Published: 28-Feb-2003; LatestRevisionDate: 13-Apr-2006; LatestRevisionNote: IPC-7351 Footprint Added.; DatasheetVersion: Jan-2002, Rev. 7; PackageVersion: rev7, Jan-2002; PackageReference: 751-07; Publisher: Altium Limited; PackageDescription: 8-Pin Plastic Small Outline Integrated Circuit 1.27 mm Pitch; Code_JEDEC: MS-012-AA; Code_IPC: SOIC127P600-8; ComponentLink1Description: Manufacturer Link; ComponentLink1URL: http://www.onsemi.com/; ComponentLink2Description: Datasheet; ComponentLink2URL: http://www.onsemi.com/pub/Collateral/LM358-D.PDF

## Sheet drvinput3.SchDoc
size A4
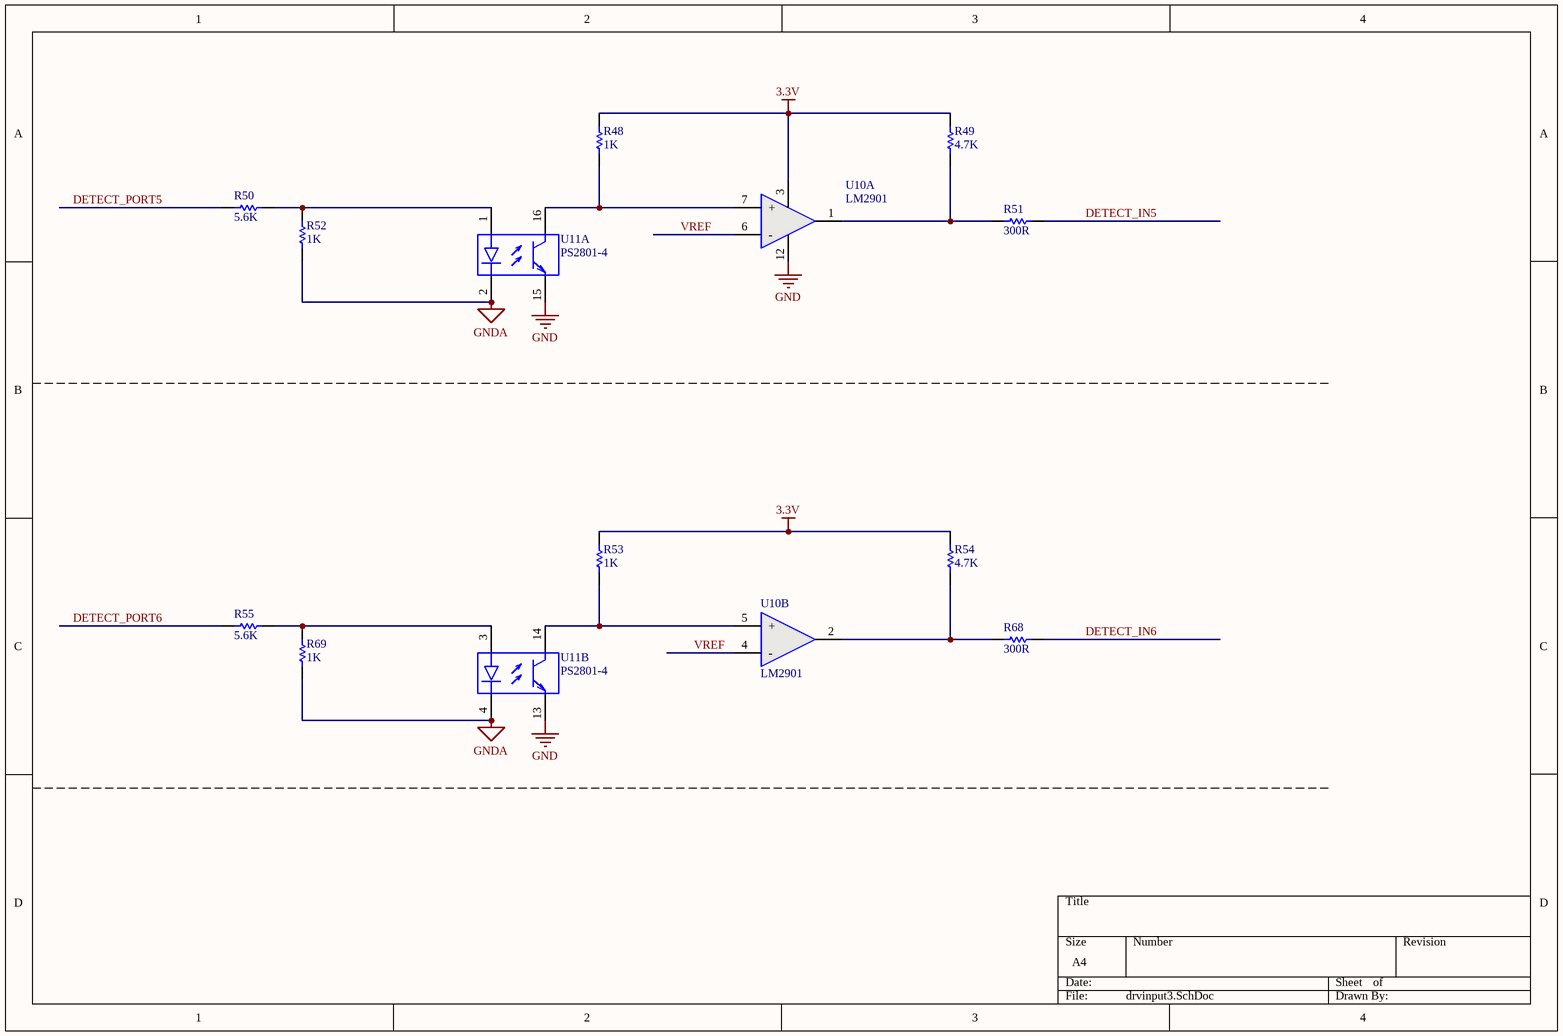
[diagram p7: drvinput3.SchDoc]

### Parts
R48  1K  [RESC2012M]
R49  4.7K  [RESC2012M]
R50  5.6K  [RESC2012M]
R51  300R  [RESC2012M]
R52  1K  [RESC2012M]
R53  1K  [RESC2012M]
R54  4.7K  [RESC2012M]
R55  5.6K  [RESC2012M]
R68  300R  [RESC2012M]
R69  1K  [RESC2012M]
U10  LM2901  [SOIC-14AM]  (parts A,B of 4)
U11  PS2801-4  [SOIC16_N]  (parts A,B of 4)

### Nets
3.3V: R48.1 R49.2 R53.1 R54.2 U10.3(V+)
GND: U10.12(V-) U11.13(E) U11.15(E)
GNDA: R52.1 R69.1 U11.2(-) U11.4(-)
DETECT_IN5: R51.1
DETECT_IN6: R68.2
DETECT_PORT5: R50.2
DETECT_PORT6: R55.2
VREF: U10.4(-) U10.6(-)
NetR48_2: R48.2 U10.7(+) U11.16(C)
NetR49_1: R49.1 R51.2 U10.1(OUT)
NetR50_1: R50.1 R52.2 U11.1(+)
NetR53_2: R53.2 U10.5(+) U11.14(C)
NetR54_1: R54.1 R68.1 U10.2(OUT)
NetR55_1: R55.1 R69.2 U11.3(+)

### Library data of the parts
R48-R55 R69 = Res1: Resistor; Value: 10K; Published: 8-Jun-2000; LatestRevisionDate: 17-Jul-2002; LatestRevisionNote: Re-released for DXP Platform.; PackageReference: AXIAL-0.3; Publisher: Altium Limited
R68 = Res1: Resistor; Value: 470; Published: 8-Jun-2000; LatestRevisionDate: 17-Jul-2002; LatestRevisionNote: Re-released for DXP Platform.; PackageReference: AXIAL-0.3; Publisher: Altium Limited
U10 = LM2901: 4通道差分比较器芯片
U11 = PS2801-4: as U7 on sheet drvinput0; Published: 28-Feb-2003; LatestRevisionDate: 13-Apr-2006; LatestRevisionNote: IPC-7351 Footprint Added.; DatasheetVersion: Jan-2002, Rev. 7; PackageVersion: rev7, Jan-2002; PackageReference: 751-07; Publisher: Altium Limited; PackageDescription: 8-Pin Plastic Small Outline Integrated Circuit 1.27 mm Pitch; Code_JEDEC: MS-012-AA; Code_IPC: SOIC127P600-8; ComponentLink1Description: Manufacturer Link; ComponentLink1URL: http://www.onsemi.com/; ComponentLink2Description: Datasheet; ComponentLink2URL: http://www.onsemi.com/pub/Collateral/LM358-D.PDF

## Sheet drvinput4.SchDoc
size A4
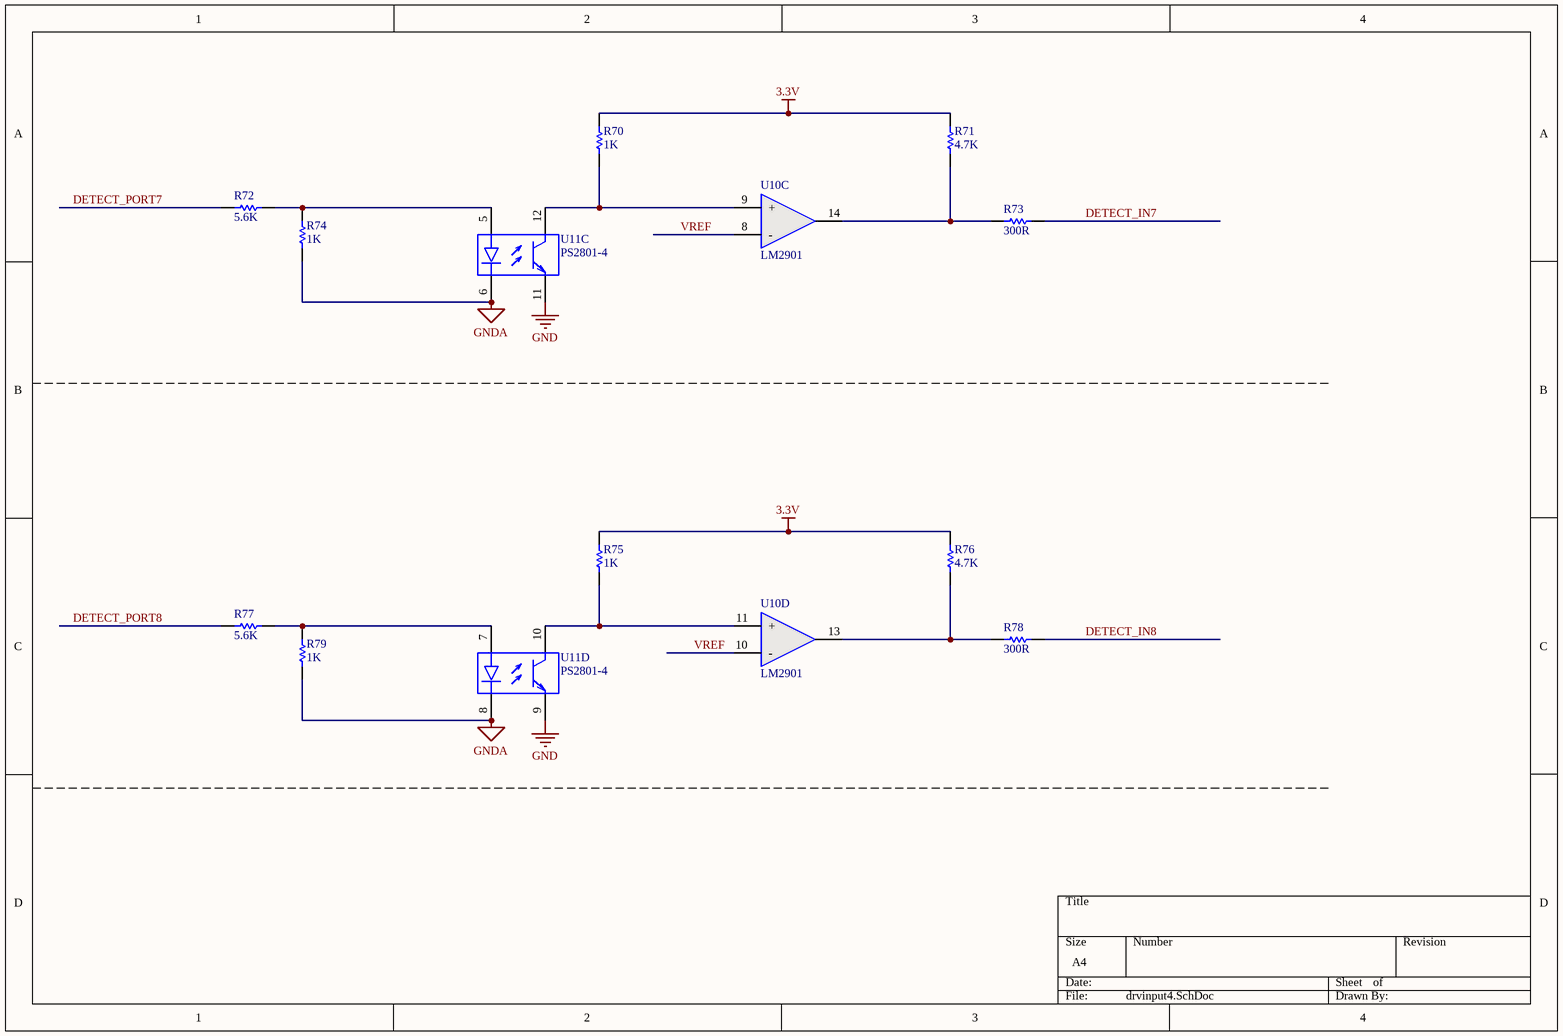
[diagram p8: drvinput4.SchDoc]

### Parts
R70  1K  [RESC2012M]
R71  4.7K  [RESC2012M]
R72  5.6K  [RESC2012M]
R73  300R  [RESC2012M]
R74  1K  [RESC2012M]
R75  1K  [RESC2012M]
R76  4.7K  [RESC2012M]
R77  5.6K  [RESC2012M]
R78  300R  [RESC2012M]
R79  1K  [RESC2012M]
U10  LM2901  [SOIC-14AM]  (parts C,D of 4)
U11  PS2801-4  [SOIC16_N]  (parts C,D of 4)

### Nets
3.3V: R70.1 R71.2 R75.1 R76.2
GND: U11.9(E) U11.11(E)
GNDA: R74.1 R79.1 U11.6(-) U11.8(-)
DETECT_IN7: R73.1
DETECT_IN8: R78.2
DETECT_PORT7: R72.2
DETECT_PORT8: R77.2
VREF: U10.8(-) U10.10(-)
NetR70_2: R70.2 U10.9(+) U11.12(C)
NetR71_1: R71.1 R73.2 U10.14(OUT)
NetR72_1: R72.1 R74.2 U11.5(+)
NetR75_2: R75.2 U10.11(+) U11.10(C)
NetR76_1: R76.1 R78.1 U10.13(OUT)
NetR77_1: R77.1 R79.2 U11.7(+)

### Library data of the parts
R70-R77 R79 = Res1: Resistor; Value: 10K; Published: 8-Jun-2000; LatestRevisionDate: 17-Jul-2002; LatestRevisionNote: Re-released for DXP Platform.; PackageReference: AXIAL-0.3; Publisher: Altium Limited
R78 = Res1: Resistor; Value: 470; Published: 8-Jun-2000; LatestRevisionDate: 17-Jul-2002; LatestRevisionNote: Re-released for DXP Platform.; PackageReference: AXIAL-0.3; Publisher: Altium Limited
U10 = LM2901: 4通道差分比较器芯片
U11 = PS2801-4: as U7 on sheet drvinput0; Published: 28-Feb-2003; LatestRevisionDate: 13-Apr-2006; LatestRevisionNote: IPC-7351 Footprint Added.; DatasheetVersion: Jan-2002, Rev. 7; PackageVersion: rev7, Jan-2002; PackageReference: 751-07; Publisher: Altium Limited; PackageDescription: 8-Pin Plastic Small Outline Integrated Circuit 1.27 mm Pitch; Code_JEDEC: MS-012-AA; Code_IPC: SOIC127P600-8; ComponentLink1Description: Manufacturer Link; ComponentLink1URL: http://www.onsemi.com/; ComponentLink2Description: Datasheet; ComponentLink2URL: http://www.onsemi.com/pub/Collateral/LM358-D.PDF

## Sheet drvinput5.SchDoc
size A4
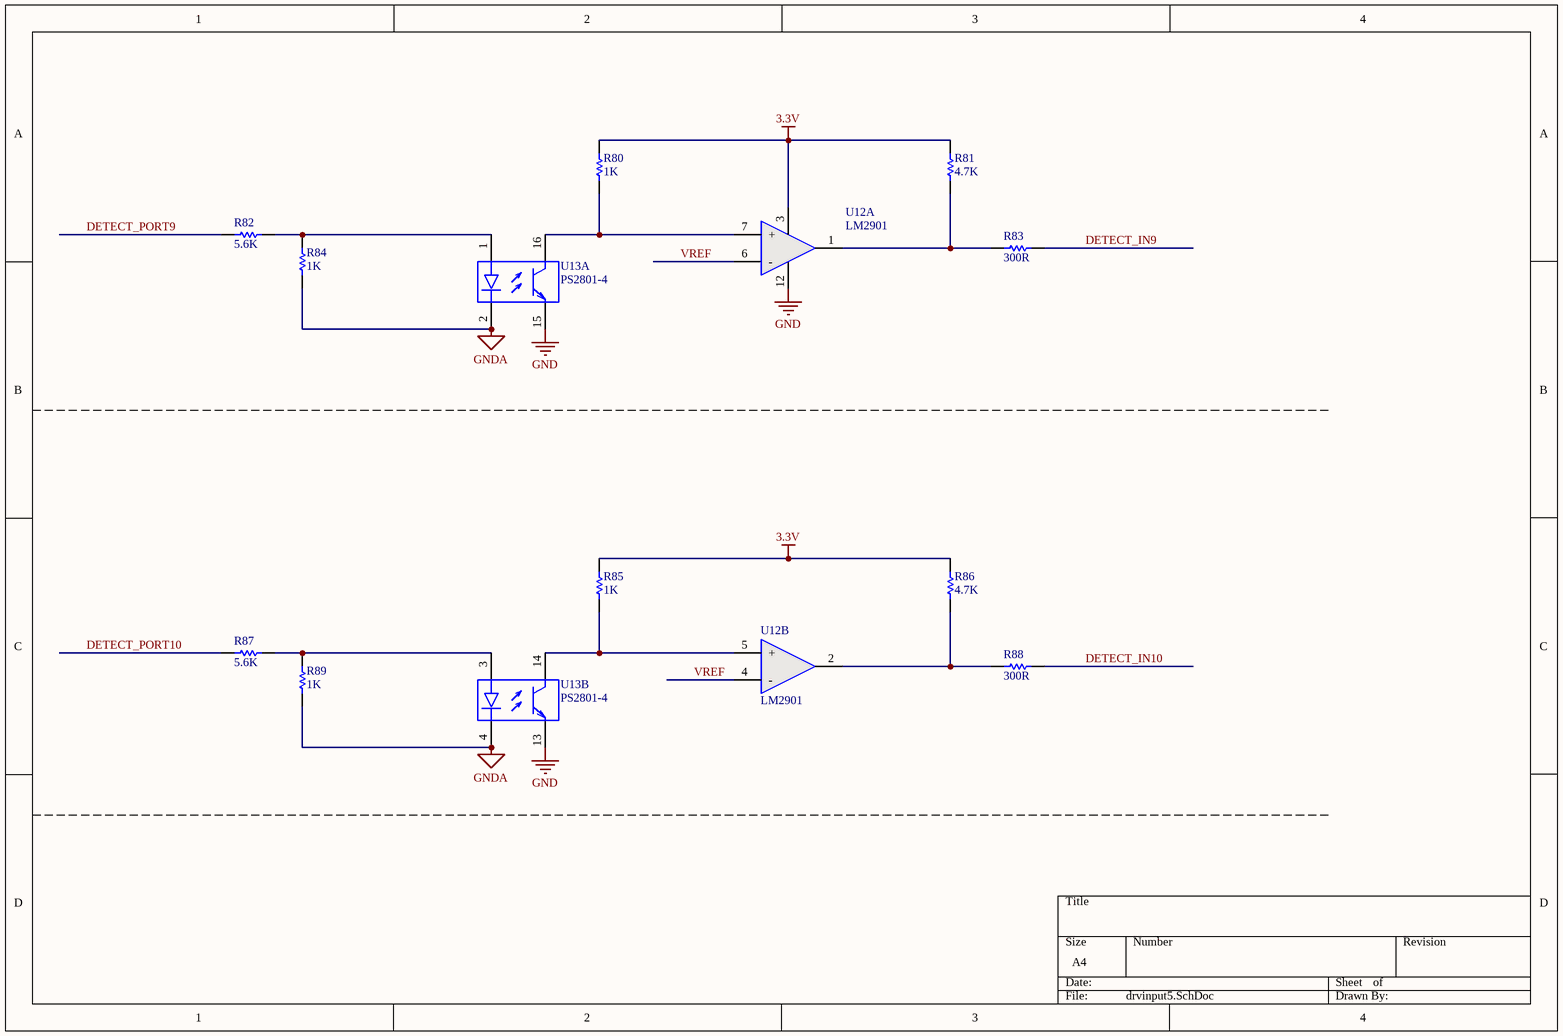
[diagram p9: drvinput5.SchDoc]

### Parts
R80  1K  [RESC2012M]
R81  4.7K  [RESC2012M]
R82  5.6K  [RESC2012M]
R83  300R  [RESC2012M]
R84  1K  [RESC2012M]
R85  1K  [RESC2012M]
R86  4.7K  [RESC2012M]
R87  5.6K  [RESC2012M]
R88  300R  [RESC2012M]
R89  1K  [RESC2012M]
U12  LM2901  [SOIC-14AM]  (parts A,B of 4)
U13  PS2801-4  [SOIC16_N]  (parts A,B of 4)

### Nets
3.3V: R80.1 R81.2 R85.1 R86.2 U12.3(V+)
GND: U12.12(V-) U13.13(E) U13.15(E)
GNDA: R84.1 R89.1 U13.2(-) U13.4(-)
DETECT_IN9: R83.1
DETECT_IN10: R88.2
DETECT_PORT9: R82.2
DETECT_PORT10: R87.2
VREF: U12.4(-) U12.6(-)
NetR80_2: R80.2 U12.7(+) U13.16(C)
NetR81_1: R81.1 R83.2 U12.1(OUT)
NetR82_1: R82.1 R84.2 U13.1(+)
NetR85_2: R85.2 U12.5(+) U13.14(C)
NetR86_1: R86.1 R88.1 U12.2(OUT)
NetR87_1: R87.1 R89.2 U13.3(+)

### Library data of the parts
R80-R87 R89 = Res1: Resistor; Value: 10K; Published: 8-Jun-2000; LatestRevisionDate: 17-Jul-2002; LatestRevisionNote: Re-released for DXP Platform.; PackageReference: AXIAL-0.3; Publisher: Altium Limited
R88 = Res1: Resistor; Value: 470; Published: 8-Jun-2000; LatestRevisionDate: 17-Jul-2002; LatestRevisionNote: Re-released for DXP Platform.; PackageReference: AXIAL-0.3; Publisher: Altium Limited
U12 = LM2901: 4通道差分比较器芯片
U13 = PS2801-4: as U7 on sheet drvinput0; Published: 28-Feb-2003; LatestRevisionDate: 13-Apr-2006; LatestRevisionNote: IPC-7351 Footprint Added.; DatasheetVersion: Jan-2002, Rev. 7; PackageVersion: rev7, Jan-2002; PackageReference: 751-07; Publisher: Altium Limited; PackageDescription: 8-Pin Plastic Small Outline Integrated Circuit 1.27 mm Pitch; Code_JEDEC: MS-012-AA; Code_IPC: SOIC127P600-8; ComponentLink1Description: Manufacturer Link; ComponentLink1URL: http://www.onsemi.com/; ComponentLink2Description: Datasheet; ComponentLink2URL: http://www.onsemi.com/pub/Collateral/LM358-D.PDF

## Sheet drvinput6.SchDoc
size A4
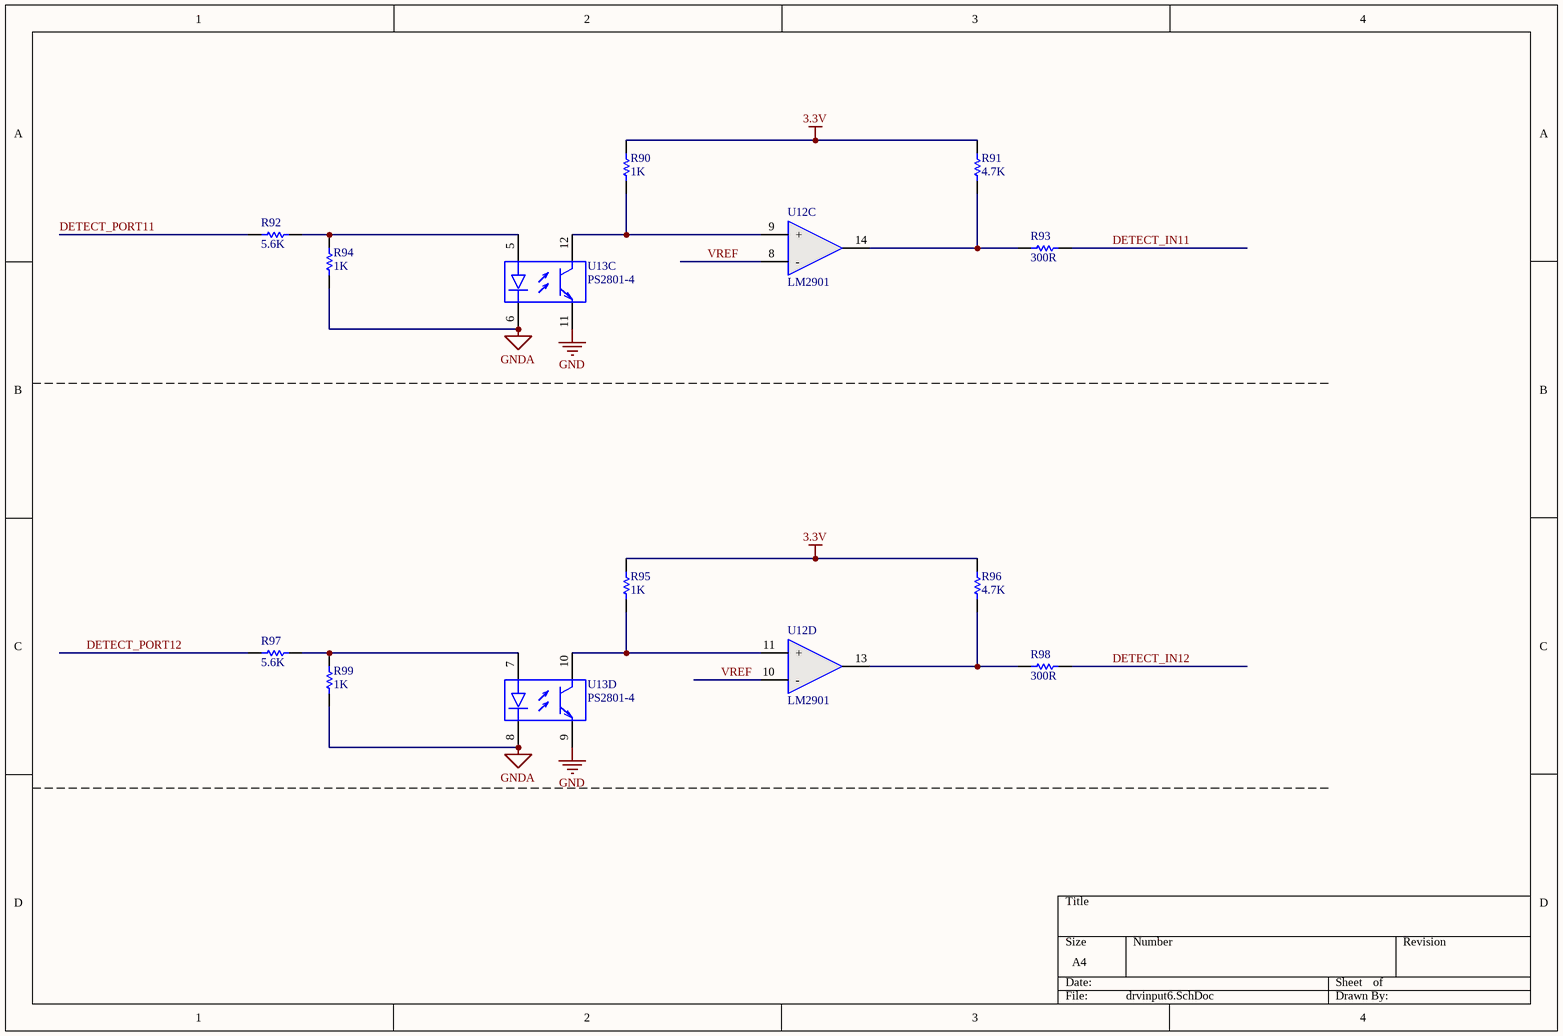
[diagram p10: drvinput6.SchDoc]

### Parts
R90  1K  [RESC2012M]
R91  4.7K  [RESC2012M]
R92  5.6K  [RESC2012M]
R93  300R  [RESC2012M]
R94  1K  [RESC2012M]
R95  1K  [RESC2012M]
R96  4.7K  [RESC2012M]
R97  5.6K  [RESC2012M]
R98  300R  [RESC2012M]
R99  1K  [RESC2012M]
U12  LM2901  [SOIC-14AM]  (parts C,D of 4)
U13  PS2801-4  [SOIC16_N]  (parts C,D of 4)

### Nets
3.3V: R90.1 R91.2 R95.1 R96.2
GND: U13.9(E) U13.11(E)
GNDA: R94.1 R99.1 U13.6(-) U13.8(-)
DETECT_IN11: R93.1
DETECT_IN12: R98.2
DETECT_PORT11: R92.2
DETECT_PORT12: R97.2
VREF: U12.8(-) U12.10(-)
NetR90_2: R90.2 U12.9(+) U13.12(C)
NetR91_1: R91.1 R93.2 U12.14(OUT)
NetR92_1: R92.1 R94.2 U13.5(+)
NetR95_2: R95.2 U12.11(+) U13.10(C)
NetR96_1: R96.1 R98.1 U12.13(OUT)
NetR97_1: R97.1 R99.2 U13.7(+)

### Library data of the parts
R90-R97 R99 = Res1: Resistor; Value: 10K; Published: 8-Jun-2000; LatestRevisionDate: 17-Jul-2002; LatestRevisionNote: Re-released for DXP Platform.; PackageReference: AXIAL-0.3; Publisher: Altium Limited
R98 = Res1: Resistor; Value: 470; Published: 8-Jun-2000; LatestRevisionDate: 17-Jul-2002; LatestRevisionNote: Re-released for DXP Platform.; PackageReference: AXIAL-0.3; Publisher: Altium Limited
U12 = LM2901: 4通道差分比较器芯片
U13 = PS2801-4: as U7 on sheet drvinput0; Published: 28-Feb-2003; LatestRevisionDate: 13-Apr-2006; LatestRevisionNote: IPC-7351 Footprint Added.; DatasheetVersion: Jan-2002, Rev. 7; PackageVersion: rev7, Jan-2002; PackageReference: 751-07; Publisher: Altium Limited; PackageDescription: 8-Pin Plastic Small Outline Integrated Circuit 1.27 mm Pitch; Code_JEDEC: MS-012-AA; Code_IPC: SOIC127P600-8; ComponentLink1Description: Manufacturer Link; ComponentLink1URL: http://www.onsemi.com/; ComponentLink2Description: Datasheet; ComponentLink2URL: http://www.onsemi.com/pub/Collateral/LM358-D.PDF

## Sheet drvoutput0.SchDoc
size A4
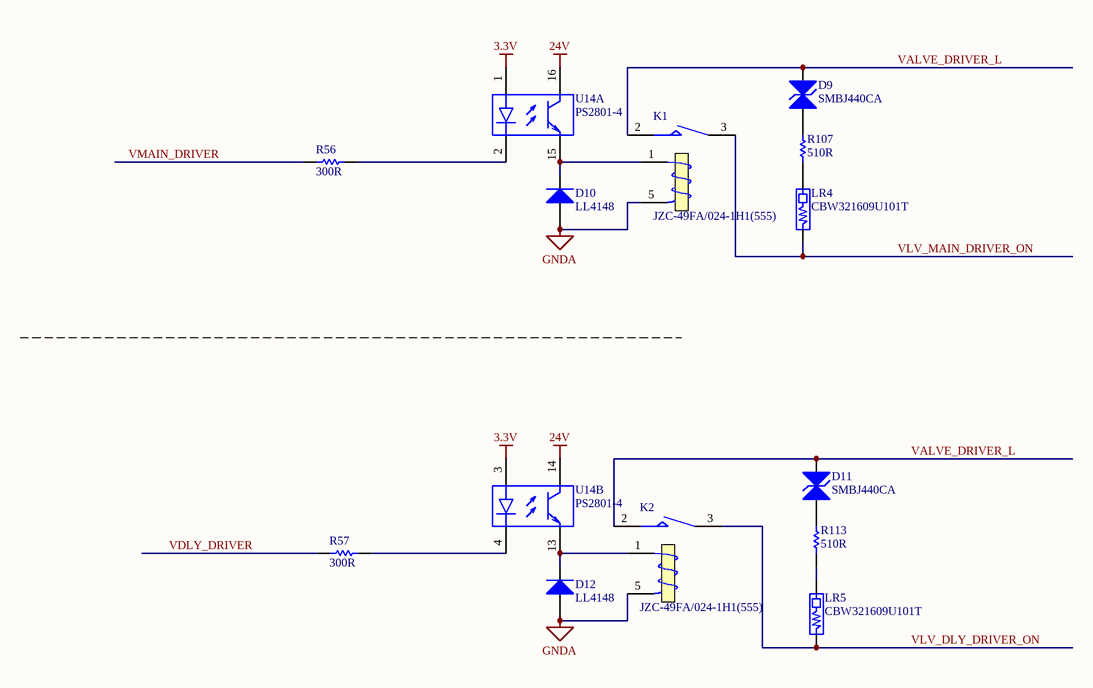
[diagram p11: drvoutput0.SchDoc]

### Parts
D9  SMBJ440CA  [SMB]
D10  LL4148  [CD2012-0805]
D11  SMBJ440CA  [SMB]
D12  LL4148  [CD2012-0805]
K1  JZC-49FA/024-1H1(555)  [JZC-49FA]
K2  JZC-49FA/024-1H1(555)  [JZC-49FA]
LR4  CBW321609U101T  [INDC3216M]
LR5  CBW321609U101T  [INDC3216M]
R56  300R  [RESC2012M]
R57  300R  [RESC2012M]
R107  510R  [RESC3216M]
R113  510R  [RESC3216M]
U14  PS2801-4  [SOIC16_N]  (parts A,B of 4)

### Nets
3.3V: U14.1(+) U14.3(+)
24V: U14.14(C) U14.16(C)
GNDA: D10.1(A) D12.1(A) K1.5(T2) K2.5(T2)
VALVE_DRIVER_L: D9.2(K) D11.2(K) K1.2(COM) K2.2(COM)
VDLY_DRIVER: R57.1
VLV_DLY_DRIVER_ON: K2.3(NO) LR5.1
VLV_MAIN_DRIVER_ON: K1.3(NO) LR4.1
VMAIN_DRIVER: R56.1
NetD9_1: D9.1(A) R107.2
NetD10_2: D10.2(K) K1.1 U14.15(E)
NetD11_1: D11.1(A) R113.2
NetD12_2: D12.2(K) K2.1 U14.13(E)
NetLR4_2: LR4.2 R107.1
NetLR5_2: LR5.2 R113.1
NetR56_2: R56.2 U14.2(-)
NetR57_2: R57.2 U14.4(-)

### Library data of the parts
D9 D11 = Bi-dir TVS Diode: Published: 8-Jun-2000; LatestRevisionDate: 17-Jul-2002; LatestRevisionNote: Re-released for DXP Platform.; PackageReference: DIODE-0.7; Publisher: Altium Limited
D10 D12 = Diode 1N4007: 1 Amp General Purpose Rectifier; Published: 8-Jun-2000; LatestRevisionDate: 17-Jul-2002; LatestRevisionNote: Re-released for DXP Platform.; DatasheetVersion: 1998; PackageVersion: Aug-1999; PackageReference: DO-41; Publisher: Altium Limited; Code_JEDEC: DO-204-AL; ComponentLink1Description: Manufacturer Link; ComponentLink1URL: http://www.fairchildsemi.com/; ComponentLink2Description: Datasheet; ComponentLink2URL: http://www.fairchildsemi.com/ds/1N%2F1N4001.pdf
K1 K2 = JZC-49FA: Intermediate  Power  Relay; Published: 8-Jun-2000; LatestRevisionDate: 17-Jul-2002; LatestRevisionNote: Re-released for DXP Platform.; PackageReference: MODULE5B; Publisher: Altium Limited
LR4 LR5 = BLM10/11/21/31/41: as LR1 on sheet drvcomm
R56 R57 = Res1: Resistor; Value: 10K; Published: 8-Jun-2000; LatestRevisionDate: 17-Jul-2002; LatestRevisionNote: Re-released for DXP Platform.; PackageReference: AXIAL-0.3; Publisher: Altium Limited
R107 R113 = Res1: Metal film Resistor; Value: 10K; Published: 8-Jun-2000; LatestRevisionDate: 17-Jul-2002; LatestRevisionNote: Re-released for DXP Platform.; PackageReference: AXIAL-0.3; Publisher: Altium Limited
U14 = PS2801-4: as U7 on sheet drvinput0; Published: 28-Feb-2003; LatestRevisionDate: 13-Apr-2006; LatestRevisionNote: IPC-7351 Footprint Added.; DatasheetVersion: Jan-2002, Rev. 7; PackageVersion: rev7, Jan-2002; PackageReference: 751-07; Publisher: Altium Limited; PackageDescription: 8-Pin Plastic Small Outline Integrated Circuit 1.27 mm Pitch; Code_JEDEC: MS-012-AA; Code_IPC: SOIC127P600-8; ComponentLink1Description: Manufacturer Link; ComponentLink1URL: http://www.onsemi.com/; ComponentLink2Description: Datasheet; ComponentLink2URL: http://www.onsemi.com/pub/Collateral/LM358-D.PDF

## Sheet drvoutput1.SchDoc
size A4
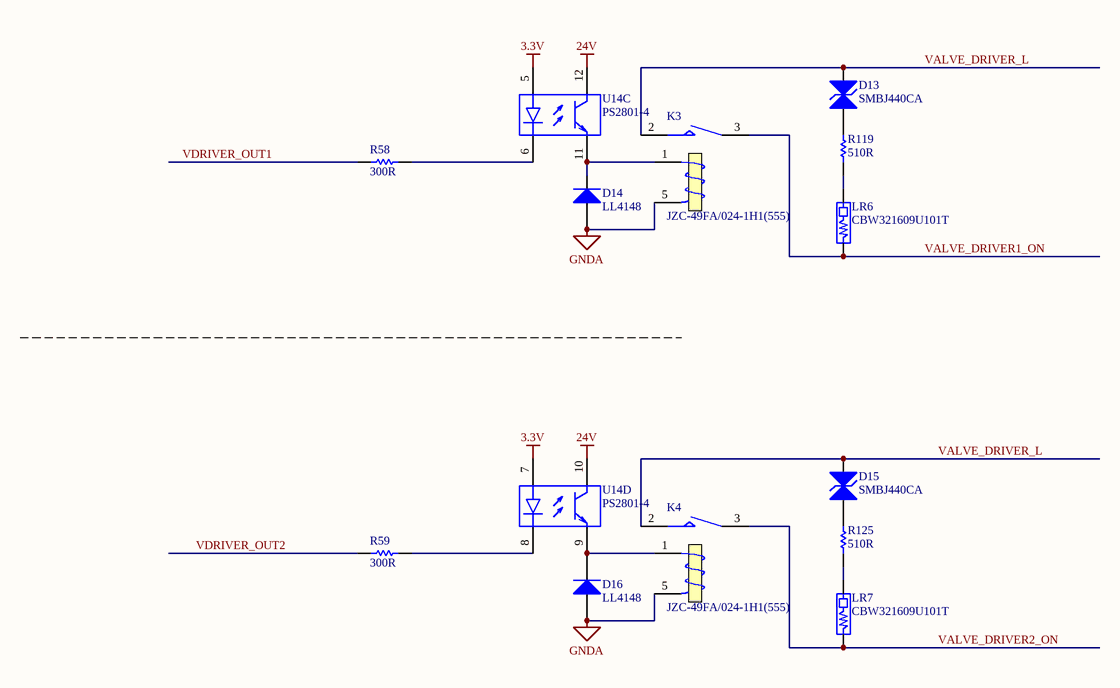
[diagram p12: drvoutput1.SchDoc]

### Parts
D13  SMBJ440CA  [SMB]
D14  LL4148  [CD2012-0805]
D15  SMBJ440CA  [SMB]
D16  LL4148  [CD2012-0805]
K3  JZC-49FA/024-1H1(555)  [JZC-49FA]
K4  JZC-49FA/024-1H1(555)  [JZC-49FA]
LR6  CBW321609U101T  [INDC3216M]
LR7  CBW321609U101T  [INDC3216M]
R58  300R  [RESC2012M]
R59  300R  [RESC2012M]
R119  510R  [RESC3216M]
R125  510R  [RESC3216M]
U14  PS2801-4  [SOIC16_N]  (parts C,D of 4)

### Nets
3.3V: U14.5(+) U14.7(+)
24V: U14.10(C) U14.12(C)
GNDA: D14.1(A) D16.1(A) K3.5(T2) K4.5(T2)
VALVE_DRIVER1_ON: K3.3(NO) LR6.1
VALVE_DRIVER2_ON: K4.3(NO) LR7.1
VALVE_DRIVER_L: D13.2(K) D15.2(K) K3.2(COM) K4.2(COM)
VDRIVER_OUT1: R58.1
VDRIVER_OUT2: R59.1
NetD13_1: D13.1(A) R119.2
NetD14_2: D14.2(K) K3.1 U14.11(E)
NetD15_1: D15.1(A) R125.2
NetD16_2: D16.2(K) K4.1 U14.9(E)
NetLR6_2: LR6.2 R119.1
NetLR7_2: LR7.2 R125.1
NetR58_2: R58.2 U14.6(-)
NetR59_2: R59.2 U14.8(-)

### Library data of the parts
D13 D15 = Bi-dir TVS Diode: Published: 8-Jun-2000; LatestRevisionDate: 17-Jul-2002; LatestRevisionNote: Re-released for DXP Platform.; PackageReference: DIODE-0.7; Publisher: Altium Limited
D14 D16 = Diode 1N4007: 1 Amp General Purpose Rectifier; Published: 8-Jun-2000; LatestRevisionDate: 17-Jul-2002; LatestRevisionNote: Re-released for DXP Platform.; DatasheetVersion: 1998; PackageVersion: Aug-1999; PackageReference: DO-41; Publisher: Altium Limited; Code_JEDEC: DO-204-AL; ComponentLink1Description: Manufacturer Link; ComponentLink1URL: http://www.fairchildsemi.com/; ComponentLink2Description: Datasheet; ComponentLink2URL: http://www.fairchildsemi.com/ds/1N%2F1N4001.pdf
K3 K4 = JZC-49FA: Intermediate  Power  Relay; Published: 8-Jun-2000; LatestRevisionDate: 17-Jul-2002; LatestRevisionNote: Re-released for DXP Platform.; PackageReference: MODULE5B; Publisher: Altium Limited
LR6 LR7 = BLM10/11/21/31/41: as LR1 on sheet drvcomm
R58 R59 = Res1: Resistor; Value: 10K; Published: 8-Jun-2000; LatestRevisionDate: 17-Jul-2002; LatestRevisionNote: Re-released for DXP Platform.; PackageReference: AXIAL-0.3; Publisher: Altium Limited
R119 R125 = Res1: Metal film Resistor; Value: 10K; Published: 8-Jun-2000; LatestRevisionDate: 17-Jul-2002; LatestRevisionNote: Re-released for DXP Platform.; PackageReference: AXIAL-0.3; Publisher: Altium Limited
U14 = PS2801-4: as U7 on sheet drvinput0; Published: 28-Feb-2003; LatestRevisionDate: 13-Apr-2006; LatestRevisionNote: IPC-7351 Footprint Added.; DatasheetVersion: Jan-2002, Rev. 7; PackageVersion: rev7, Jan-2002; PackageReference: 751-07; Publisher: Altium Limited; PackageDescription: 8-Pin Plastic Small Outline Integrated Circuit 1.27 mm Pitch; Code_JEDEC: MS-012-AA; Code_IPC: SOIC127P600-8; ComponentLink1Description: Manufacturer Link; ComponentLink1URL: http://www.onsemi.com/; ComponentLink2Description: Datasheet; ComponentLink2URL: http://www.onsemi.com/pub/Collateral/LM358-D.PDF

## Sheet drvoutput2.SchDoc
size A4
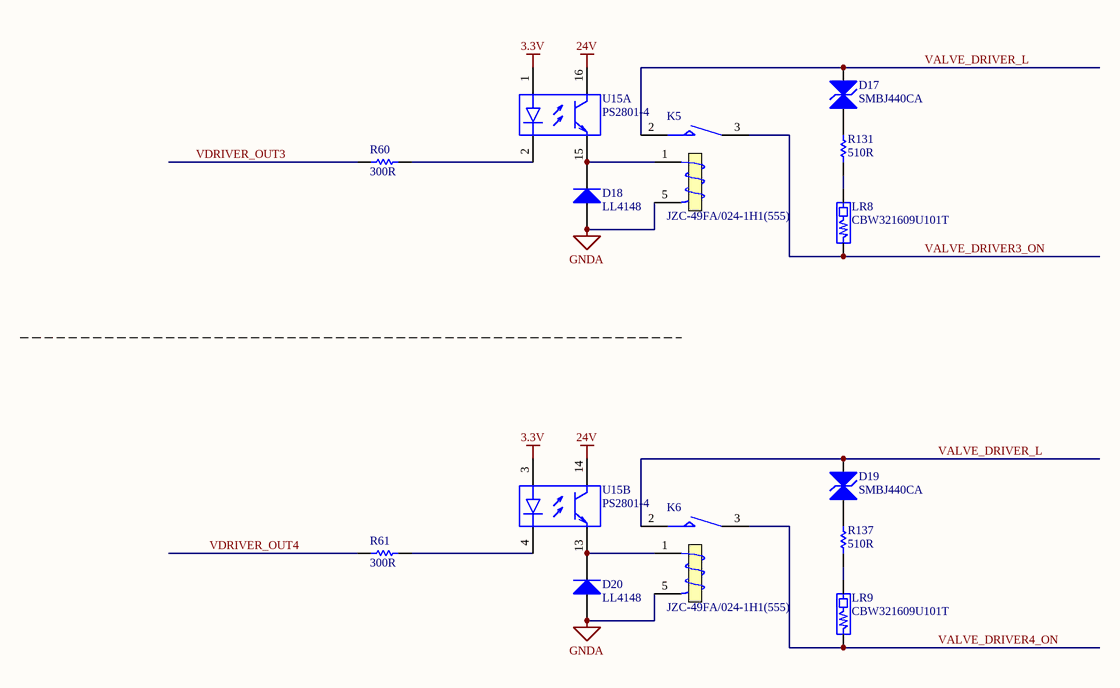
[diagram p13: drvoutput2.SchDoc]

### Parts
D17  SMBJ440CA  [SMB]
D18  LL4148  [CD2012-0805]
D19  SMBJ440CA  [SMB]
D20  LL4148  [CD2012-0805]
K5  JZC-49FA/024-1H1(555)  [JZC-49FA]
K6  JZC-49FA/024-1H1(555)  [JZC-49FA]
LR8  CBW321609U101T  [INDC3216M]
LR9  CBW321609U101T  [INDC3216M]
R60  300R  [RESC2012M]
R61  300R  [RESC2012M]
R131  510R  [RESC3216M]
R137  510R  [RESC3216M]
U15  PS2801-4  [SOIC16_N]  (parts A,B of 4)

### Nets
3.3V: U15.1(+) U15.3(+)
24V: U15.14(C) U15.16(C)
GNDA: D18.1(A) D20.1(A) K5.5(T2) K6.5(T2)
VALVE_DRIVER3_ON: K5.3(NO) LR8.1
VALVE_DRIVER4_ON: K6.3(NO) LR9.1
VALVE_DRIVER_L: D17.2(K) D19.2(K) K5.2(COM) K6.2(COM)
VDRIVER_OUT3: R60.1
VDRIVER_OUT4: R61.1
NetD17_1: D17.1(A) R131.2
NetD18_2: D18.2(K) K5.1 U15.15(E)
NetD19_1: D19.1(A) R137.2
NetD20_2: D20.2(K) K6.1 U15.13(E)
NetLR8_2: LR8.2 R131.1
NetLR9_2: LR9.2 R137.1
NetR60_2: R60.2 U15.2(-)
NetR61_2: R61.2 U15.4(-)

### Library data of the parts
D17 D19 = Bi-dir TVS Diode: Published: 8-Jun-2000; LatestRevisionDate: 17-Jul-2002; LatestRevisionNote: Re-released for DXP Platform.; PackageReference: DIODE-0.7; Publisher: Altium Limited
D18 D20 = Diode 1N4007: 1 Amp General Purpose Rectifier; Published: 8-Jun-2000; LatestRevisionDate: 17-Jul-2002; LatestRevisionNote: Re-released for DXP Platform.; DatasheetVersion: 1998; PackageVersion: Aug-1999; PackageReference: DO-41; Publisher: Altium Limited; Code_JEDEC: DO-204-AL; ComponentLink1Description: Manufacturer Link; ComponentLink1URL: http://www.fairchildsemi.com/; ComponentLink2Description: Datasheet; ComponentLink2URL: http://www.fairchildsemi.com/ds/1N%2F1N4001.pdf
K5 K6 = JZC-49FA: Intermediate  Power  Relay; Published: 8-Jun-2000; LatestRevisionDate: 17-Jul-2002; LatestRevisionNote: Re-released for DXP Platform.; PackageReference: MODULE5B; Publisher: Altium Limited
LR8 LR9 = BLM10/11/21/31/41: as LR1 on sheet drvcomm
R60 R61 = Res1: Resistor; Value: 10K; Published: 8-Jun-2000; LatestRevisionDate: 17-Jul-2002; LatestRevisionNote: Re-released for DXP Platform.; PackageReference: AXIAL-0.3; Publisher: Altium Limited
R131 R137 = Res1: Metal film Resistor; Value: 10K; Published: 8-Jun-2000; LatestRevisionDate: 17-Jul-2002; LatestRevisionNote: Re-released for DXP Platform.; PackageReference: AXIAL-0.3; Publisher: Altium Limited
U15 = PS2801-4: as U7 on sheet drvinput0; Published: 28-Feb-2003; LatestRevisionDate: 13-Apr-2006; LatestRevisionNote: IPC-7351 Footprint Added.; DatasheetVersion: Jan-2002, Rev. 7; PackageVersion: rev7, Jan-2002; PackageReference: 751-07; Publisher: Altium Limited; PackageDescription: 8-Pin Plastic Small Outline Integrated Circuit 1.27 mm Pitch; Code_JEDEC: MS-012-AA; Code_IPC: SOIC127P600-8; ComponentLink1Description: Manufacturer Link; ComponentLink1URL: http://www.onsemi.com/; ComponentLink2Description: Datasheet; ComponentLink2URL: http://www.onsemi.com/pub/Collateral/LM358-D.PDF

## Sheet drvoutput3.SchDoc
size A4
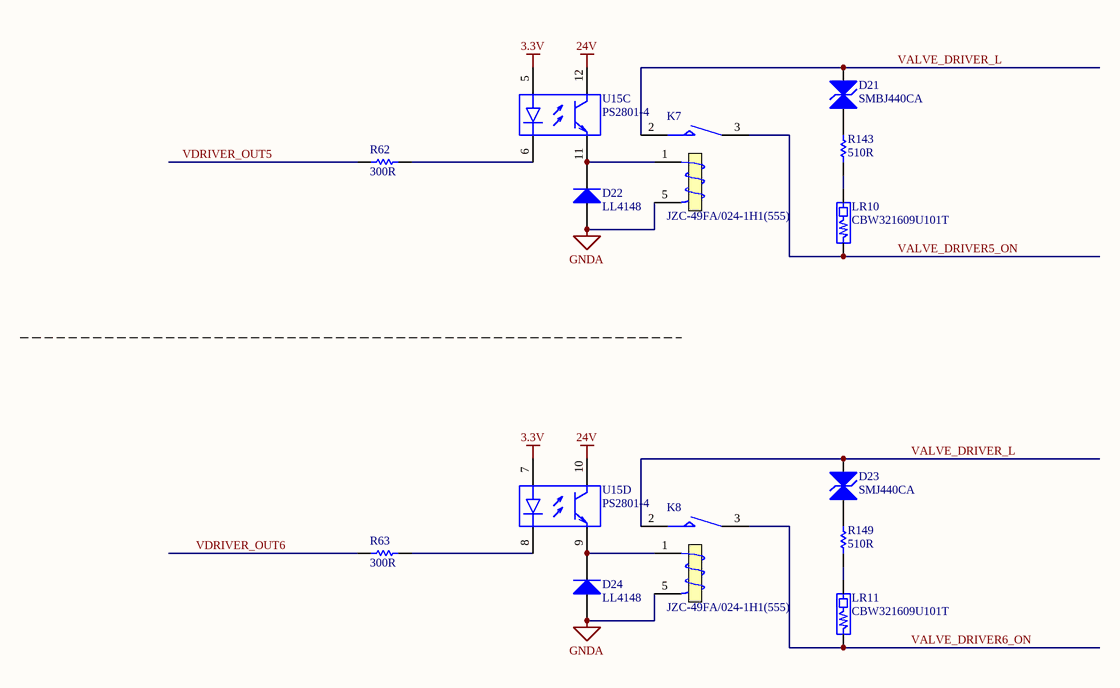
[diagram p14: drvoutput3.SchDoc]

### Parts
D21  SMBJ440CA  [SMB]
D22  LL4148  [CD2012-0805]
D23  SMJ440CA  [SMB]
D24  LL4148  [CD2012-0805]
K7  JZC-49FA/024-1H1(555)  [JZC-49FA]
K8  JZC-49FA/024-1H1(555)  [JZC-49FA]
LR10  CBW321609U101T  [INDC3216M]
LR11  CBW321609U101T  [INDC3216M]
R62  300R  [RESC2012M]
R63  300R  [RESC2012M]
R143  510R  [RESC3216M]
R149  510R  [RESC3216M]
U15  PS2801-4  [SOIC16_N]  (parts C,D of 4)

### Nets
3.3V: U15.5(+) U15.7(+)
24V: U15.10(C) U15.12(C)
GNDA: D22.1(A) D24.1(A) K7.5(T2) K8.5(T2)
VALVE_DRIVER5_ON: K7.3(NO) LR10.1
VALVE_DRIVER6_ON: K8.3(NO) LR11.1
VALVE_DRIVER_L: D21.2(K) D23.2(K) K7.2(COM) K8.2(COM)
VDRIVER_OUT5: R62.1
VDRIVER_OUT6: R63.1
NetD21_1: D21.1(A) R143.2
NetD22_2: D22.2(K) K7.1 U15.11(E)
NetD23_1: D23.1(A) R149.2
NetD24_2: D24.2(K) K8.1 U15.9(E)
NetLR10_2: LR10.2 R143.1
NetLR11_2: LR11.2 R149.1
NetR62_2: R62.2 U15.6(-)
NetR63_2: R63.2 U15.8(-)

### Library data of the parts
D21 D23 = Bi-dir TVS Diode: Published: 8-Jun-2000; LatestRevisionDate: 17-Jul-2002; LatestRevisionNote: Re-released for DXP Platform.; PackageReference: DIODE-0.7; Publisher: Altium Limited
D22 D24 = Diode 1N4007: 1 Amp General Purpose Rectifier; Published: 8-Jun-2000; LatestRevisionDate: 17-Jul-2002; LatestRevisionNote: Re-released for DXP Platform.; DatasheetVersion: 1998; PackageVersion: Aug-1999; PackageReference: DO-41; Publisher: Altium Limited; Code_JEDEC: DO-204-AL; ComponentLink1Description: Manufacturer Link; ComponentLink1URL: http://www.fairchildsemi.com/; ComponentLink2Description: Datasheet; ComponentLink2URL: http://www.fairchildsemi.com/ds/1N%2F1N4001.pdf
K7 K8 = JZC-49FA: Intermediate  Power  Relay; Published: 8-Jun-2000; LatestRevisionDate: 17-Jul-2002; LatestRevisionNote: Re-released for DXP Platform.; PackageReference: MODULE5B; Publisher: Altium Limited
LR10 LR11 = BLM10/11/21/31/41: as LR1 on sheet drvcomm
R62 R63 = Res1: Resistor; Value: 10K; Published: 8-Jun-2000; LatestRevisionDate: 17-Jul-2002; LatestRevisionNote: Re-released for DXP Platform.; PackageReference: AXIAL-0.3; Publisher: Altium Limited
R143 R149 = Res1: Metal film Resistor; Value: 10K; Published: 8-Jun-2000; LatestRevisionDate: 17-Jul-2002; LatestRevisionNote: Re-released for DXP Platform.; PackageReference: AXIAL-0.3; Publisher: Altium Limited
U15 = PS2801-4: as U7 on sheet drvinput0; Published: 28-Feb-2003; LatestRevisionDate: 13-Apr-2006; LatestRevisionNote: IPC-7351 Footprint Added.; DatasheetVersion: Jan-2002, Rev. 7; PackageVersion: rev7, Jan-2002; PackageReference: 751-07; Publisher: Altium Limited; PackageDescription: 8-Pin Plastic Small Outline Integrated Circuit 1.27 mm Pitch; Code_JEDEC: MS-012-AA; Code_IPC: SOIC127P600-8; ComponentLink1Description: Manufacturer Link; ComponentLink1URL: http://www.onsemi.com/; ComponentLink2Description: Datasheet; ComponentLink2URL: http://www.onsemi.com/pub/Collateral/LM358-D.PDF

## Sheet drvoutput4.SchDoc
size A4
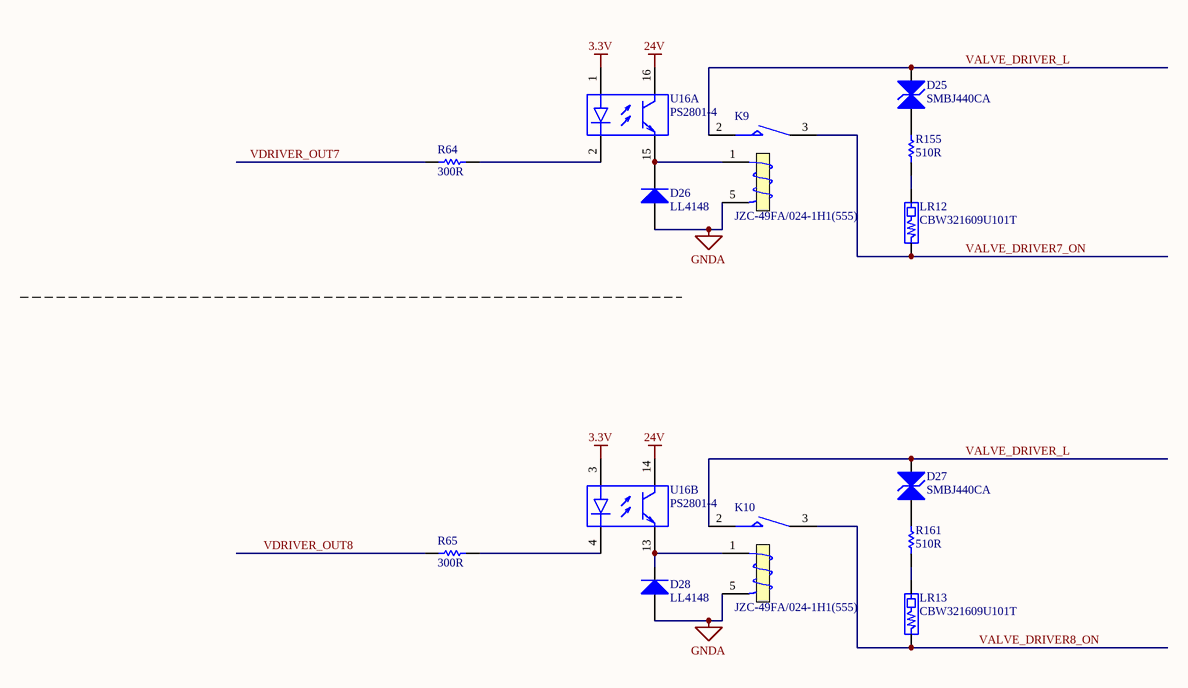
[diagram p15: drvoutput4.SchDoc]

### Parts
D25  SMBJ440CA  [SMB]
D26  LL4148  [CD2012-0805]
D27  SMBJ440CA  [SMB]
D28  LL4148  [CD2012-0805]
K9  JZC-49FA/024-1H1(555)  [JZC-49FA]
K10  JZC-49FA/024-1H1(555)  [JZC-49FA]
LR12  CBW321609U101T  [INDC3216M]
LR13  CBW321609U101T  [INDC3216M]
R64  300R  [RESC2012M]
R65  300R  [RESC2012M]
R155  510R  [RESC3216M]
R161  510R  [RESC3216M]
U16  PS2801-4  [SOIC16_N]  (parts A,B of 4)

### Nets
3.3V: U16.1(+) U16.3(+)
24V: U16.14(C) U16.16(C)
GNDA: D26.1(A) D28.1(A) K9.5(T2) K10.5(T2)
VALVE_DRIVER7_ON: K9.3(NO) LR12.1
VALVE_DRIVER8_ON: K10.3(NO) LR13.1
VALVE_DRIVER_L: D25.2(K) D27.2(K) K9.2(COM) K10.2(COM)
VDRIVER_OUT7: R64.1
VDRIVER_OUT8: R65.1
NetD25_1: D25.1(A) R155.2
NetD26_2: D26.2(K) K9.1 U16.15(E)
NetD27_1: D27.1(A) R161.2
NetD28_2: D28.2(K) K10.1 U16.13(E)
NetLR12_2: LR12.2 R155.1
NetLR13_2: LR13.2 R161.1
NetR64_2: R64.2 U16.2(-)
NetR65_2: R65.2 U16.4(-)

### Library data of the parts
D25 D27 = Bi-dir TVS Diode: Published: 8-Jun-2000; LatestRevisionDate: 17-Jul-2002; LatestRevisionNote: Re-released for DXP Platform.; PackageReference: DIODE-0.7; Publisher: Altium Limited
D26 D28 = Diode 1N4007: 1 Amp General Purpose Rectifier; Published: 8-Jun-2000; LatestRevisionDate: 17-Jul-2002; LatestRevisionNote: Re-released for DXP Platform.; DatasheetVersion: 1998; PackageVersion: Aug-1999; PackageReference: DO-41; Publisher: Altium Limited; Code_JEDEC: DO-204-AL; ComponentLink1Description: Manufacturer Link; ComponentLink1URL: http://www.fairchildsemi.com/; ComponentLink2Description: Datasheet; ComponentLink2URL: http://www.fairchildsemi.com/ds/1N%2F1N4001.pdf
K9 K10 = JZC-49FA: Intermediate  Power  Relay; Published: 8-Jun-2000; LatestRevisionDate: 17-Jul-2002; LatestRevisionNote: Re-released for DXP Platform.; PackageReference: MODULE5B; Publisher: Altium Limited
LR12 LR13 = BLM10/11/21/31/41: as LR1 on sheet drvcomm
R64 R65 = Res1: Resistor; Value: 10K; Published: 8-Jun-2000; LatestRevisionDate: 17-Jul-2002; LatestRevisionNote: Re-released for DXP Platform.; PackageReference: AXIAL-0.3; Publisher: Altium Limited
R155 R161 = Res1: Metal film Resistor; Value: 10K; Published: 8-Jun-2000; LatestRevisionDate: 17-Jul-2002; LatestRevisionNote: Re-released for DXP Platform.; PackageReference: AXIAL-0.3; Publisher: Altium Limited
U16 = PS2801-4: as U7 on sheet drvinput0; Published: 28-Feb-2003; LatestRevisionDate: 13-Apr-2006; LatestRevisionNote: IPC-7351 Footprint Added.; DatasheetVersion: Jan-2002, Rev. 7; PackageVersion: rev7, Jan-2002; PackageReference: 751-07; Publisher: Altium Limited; PackageDescription: 8-Pin Plastic Small Outline Integrated Circuit 1.27 mm Pitch; Code_JEDEC: MS-012-AA; Code_IPC: SOIC127P600-8; ComponentLink1Description: Manufacturer Link; ComponentLink1URL: http://www.onsemi.com/; ComponentLink2Description: Datasheet; ComponentLink2URL: http://www.onsemi.com/pub/Collateral/LM358-D.PDF